# EAGLE design Cell Charger BMS rev1 (EAGLE 9.6.2)
ENGINEER: Arvind Srinivasan

## Sheet 1 of 2: Lower 9 Cell Connections
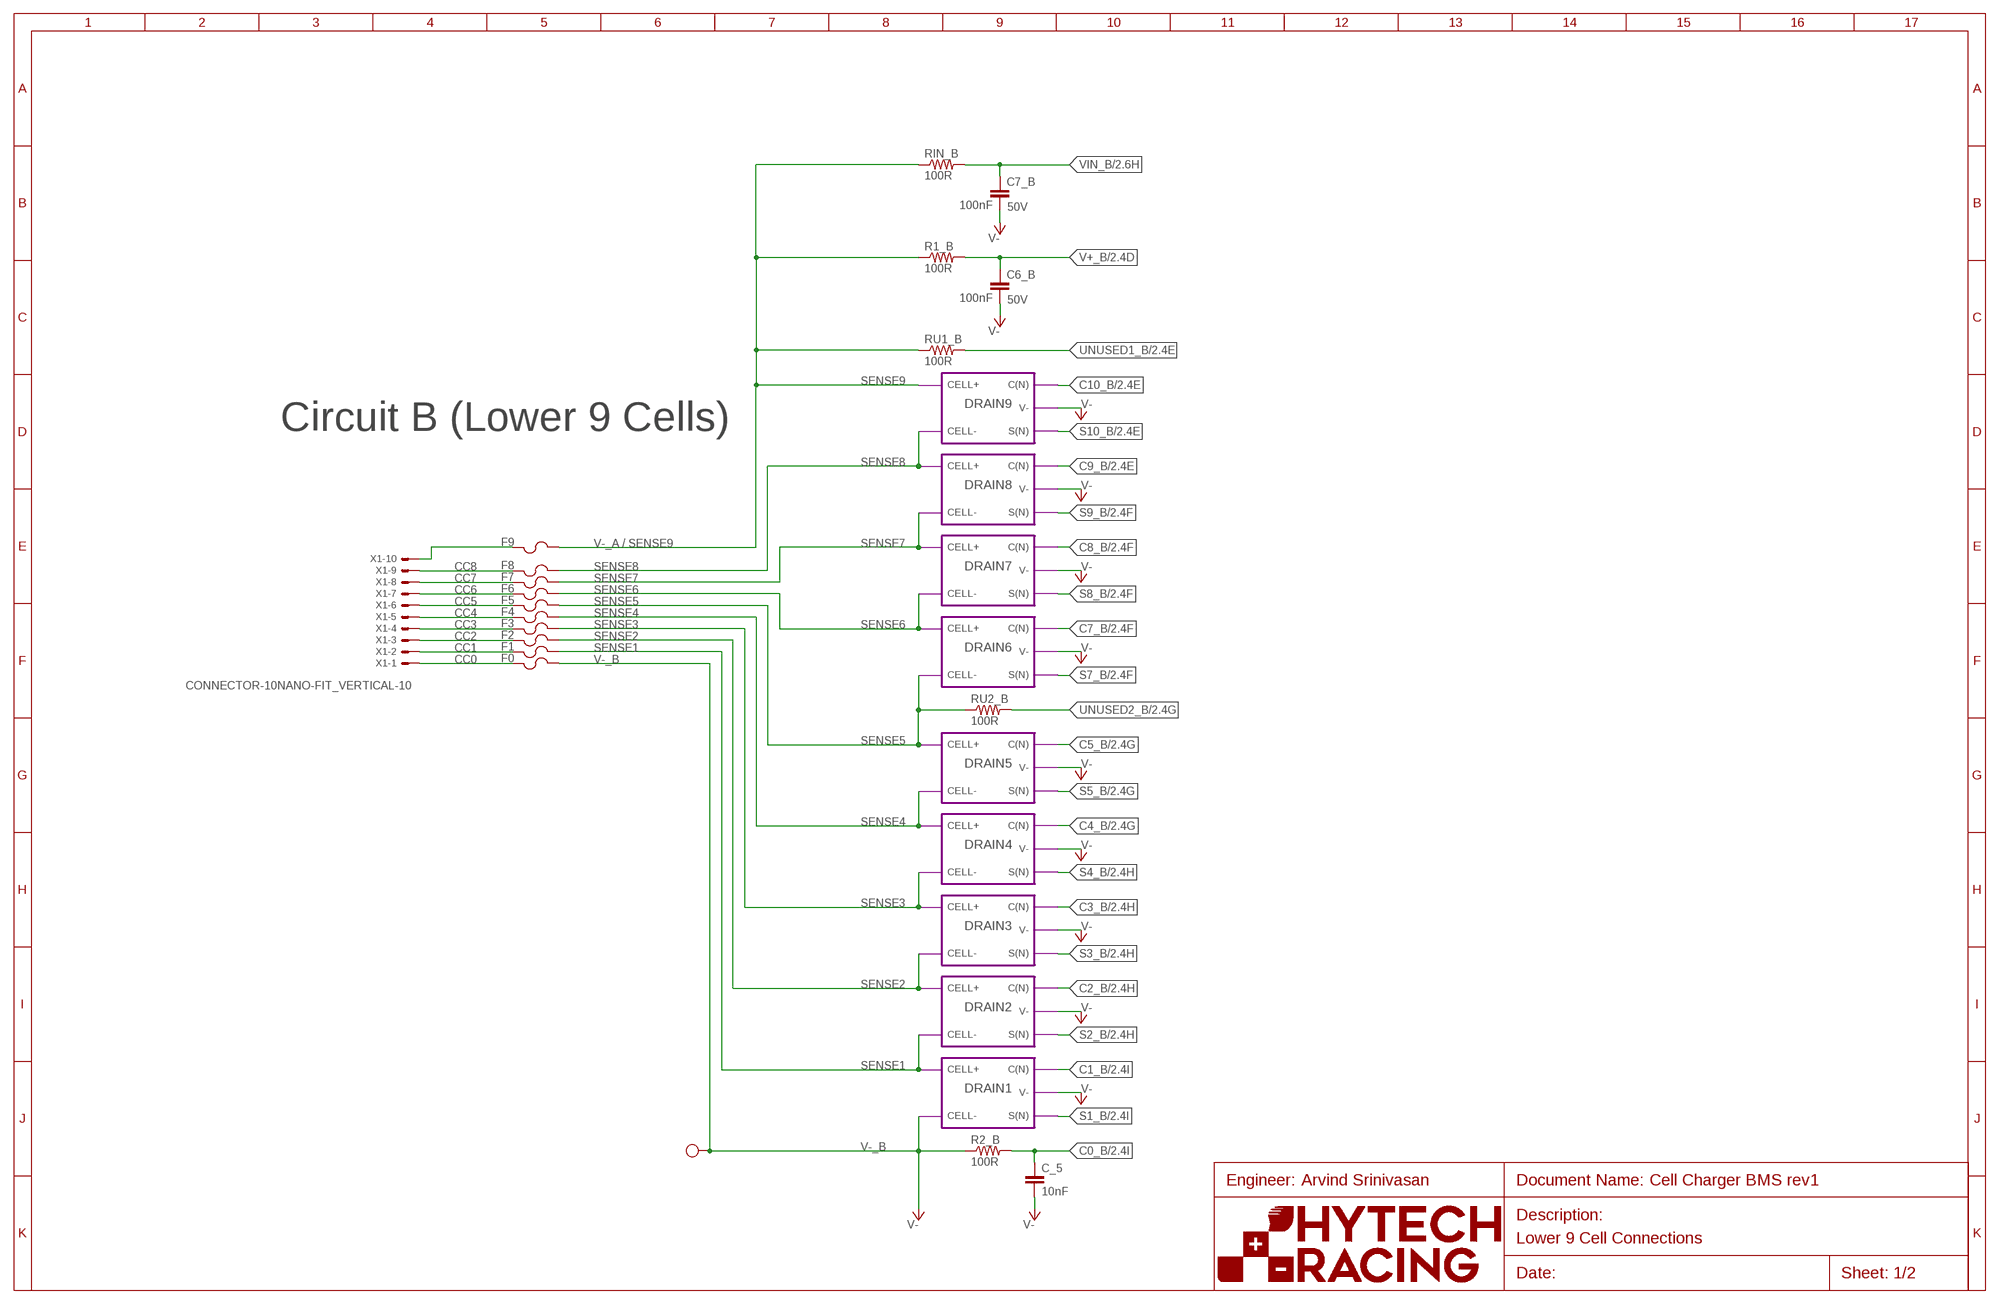
[diagram p0: schematic, sheet 1]
U$25 (FRAME_B): ENGINEER: Arvind Srinivasan; FRAME_DESCRIPTION: Lower 9 Cell Connections; ORIENTATION: LANDSCAPE; SIZE: B

### Parts
C6_B  100nF  CAP0603-CAP  [0603-CAP]
C7_B  100nF  CAP0603-CAP  [0603-CAP]
C_5  10nF  CAP0603-CAP  [0603-CAP]
F0  0001.2704.11  [5X20MM_FUSE]
F1  0001.2704.11  [5X20MM_FUSE]
F2  0001.2704.11  [5X20MM_FUSE]
F3  0001.2704.11  [5X20MM_FUSE]
F4  0001.2704.11  [5X20MM_FUSE]
F5  0001.2704.11  [5X20MM_FUSE]
F6  0001.2704.11  [5X20MM_FUSE]
F7  0001.2704.11  [5X20MM_FUSE]
F8  0001.2704.11  [5X20MM_FUSE]
F9  0001.2704.11  [5X20MM_FUSE]
R1_B  100R  RESISTOR0603-RES  [0603-RES]
R2_B  100R  RESISTOR0603-RES  [0603-RES]
RIN_B  100R  RESISTOR0603-RES  [0603-RES]
RU1_B  100R  RESISTOR0603-RES  [0603-RES]
RU2_B  100R  RESISTOR0603-RES  [0603-RES]
U$6  TEST_POINT  [TEST_POINT]
X1  CONNECTOR-10NANO-FIT_VERTICAL-10  [1053101210]

### Module instances
DRAIN1 = CELL_VOLTAGE_FILTER+DRAIN
DRAIN2 = CELL_VOLTAGE_FILTER+DRAIN
DRAIN3 = CELL_VOLTAGE_FILTER+DRAIN
DRAIN4 = CELL_VOLTAGE_FILTER+DRAIN
DRAIN5 = CELL_VOLTAGE_FILTER+DRAIN
DRAIN6 = CELL_VOLTAGE_FILTER+DRAIN
DRAIN7 = CELL_VOLTAGE_FILTER+DRAIN
DRAIN8 = CELL_VOLTAGE_FILTER+DRAIN
DRAIN9 = CELL_VOLTAGE_FILTER+DRAIN

### Nets
C0_B: C_5.1 R2_B.2 ; also sheet 2
C1_B: port DRAIN1.C(N) ; also sheet 2
C2_B: port DRAIN2.C(N) ; also sheet 2
C3_B: port DRAIN3.C(N) ; also sheet 2
C4_B: port DRAIN4.C(N) ; also sheet 2
C5_B: port DRAIN5.C(N) ; also sheet 2
C7_B: port DRAIN6.C(N) ; also sheet 2
C8_B: port DRAIN7.C(N) ; also sheet 2
C9_B: port DRAIN8.C(N) ; also sheet 2
C10_B: port DRAIN9.C(N) ; also sheet 2
CC0 [unfused_hv]: F0.P$1 X1.P$1
CC1 [unfused_hv]: F1.P$1 X1.P$2
CC2 [unfused_hv]: F2.P$1 X1.P$3
CC3 [unfused_hv]: F3.P$1 X1.P$4
CC4 [unfused_hv]: F4.P$1 X1.P$5
CC5 [unfused_hv]: F5.P$1 X1.P$6
CC6 [unfused_hv]: F6.P$1 X1.P$7
CC7 [unfused_hv]: F7.P$1 X1.P$8
CC8 [unfused_hv]: F8.P$1 X1.P$9
N$3: F9.P$1 X1.P$10
S1_B: port DRAIN1.S(N) ; also sheet 2
S2_B: port DRAIN2.S(N) ; also sheet 2
S3_B: port DRAIN3.S(N) ; also sheet 2
S4_B: port DRAIN4.S(N) ; also sheet 2
S5_B: port DRAIN5.S(N) ; also sheet 2
S7_B: port DRAIN6.S(N) ; also sheet 2
S8_B: port DRAIN7.S(N) ; also sheet 2
S9_B: port DRAIN8.S(N) ; also sheet 2
S10_B: port DRAIN9.S(N) ; also sheet 2
SENSE1: F1.P$2 ; port DRAIN1.CELL+ DRAIN2.CELL-
SENSE2: F2.P$2 ; port DRAIN2.CELL+ DRAIN3.CELL-
SENSE3: F3.P$2 ; port DRAIN3.CELL+ DRAIN4.CELL-
SENSE4: F4.P$2 ; port DRAIN4.CELL+ DRAIN5.CELL-
SENSE5: F5.P$2 RU2_B.1 ; port DRAIN5.CELL+ DRAIN6.CELL-
SENSE6: F6.P$2 ; port DRAIN6.CELL+ DRAIN7.CELL-
SENSE7: F7.P$2 ; port DRAIN7.CELL+ DRAIN8.CELL-
SENSE8: F8.P$2 ; port DRAIN8.CELL+ DRAIN9.CELL-
UNUSED1_B: RU1_B.2 ; also sheet 2
UNUSED2_B: RU2_B.2 ; also sheet 2
V+_B: C6_B.1 R1_B.2 ; also sheet 2
V-_A: F9.P$2 R1_B.1 RIN_B.1 RU1_B.1 ; port DRAIN9.CELL+
V-_B: C6_B.2 C7_B.2 C_5.2 F0.P$2 R2_B.1 U$6.P$1 ; port DRAIN1.CELL- DRAIN9.V- DRAIN8.V- DRAIN7.V- DRAIN6.V- DRAIN5.V- DRAIN4.V- DRAIN3.V- DRAIN2.V- DRAIN1.V- ; supply symbol labelled V- ; also sheet 2
VIN_B: C7_B.1 RIN_B.2 ; also sheet 2

### Notes on the sheet
- SENSE9
- Circuit B (Lower 9 Cells)
- V-_A / SENSE9

## Sheet 2 of 2: Upper LTC6811 IC
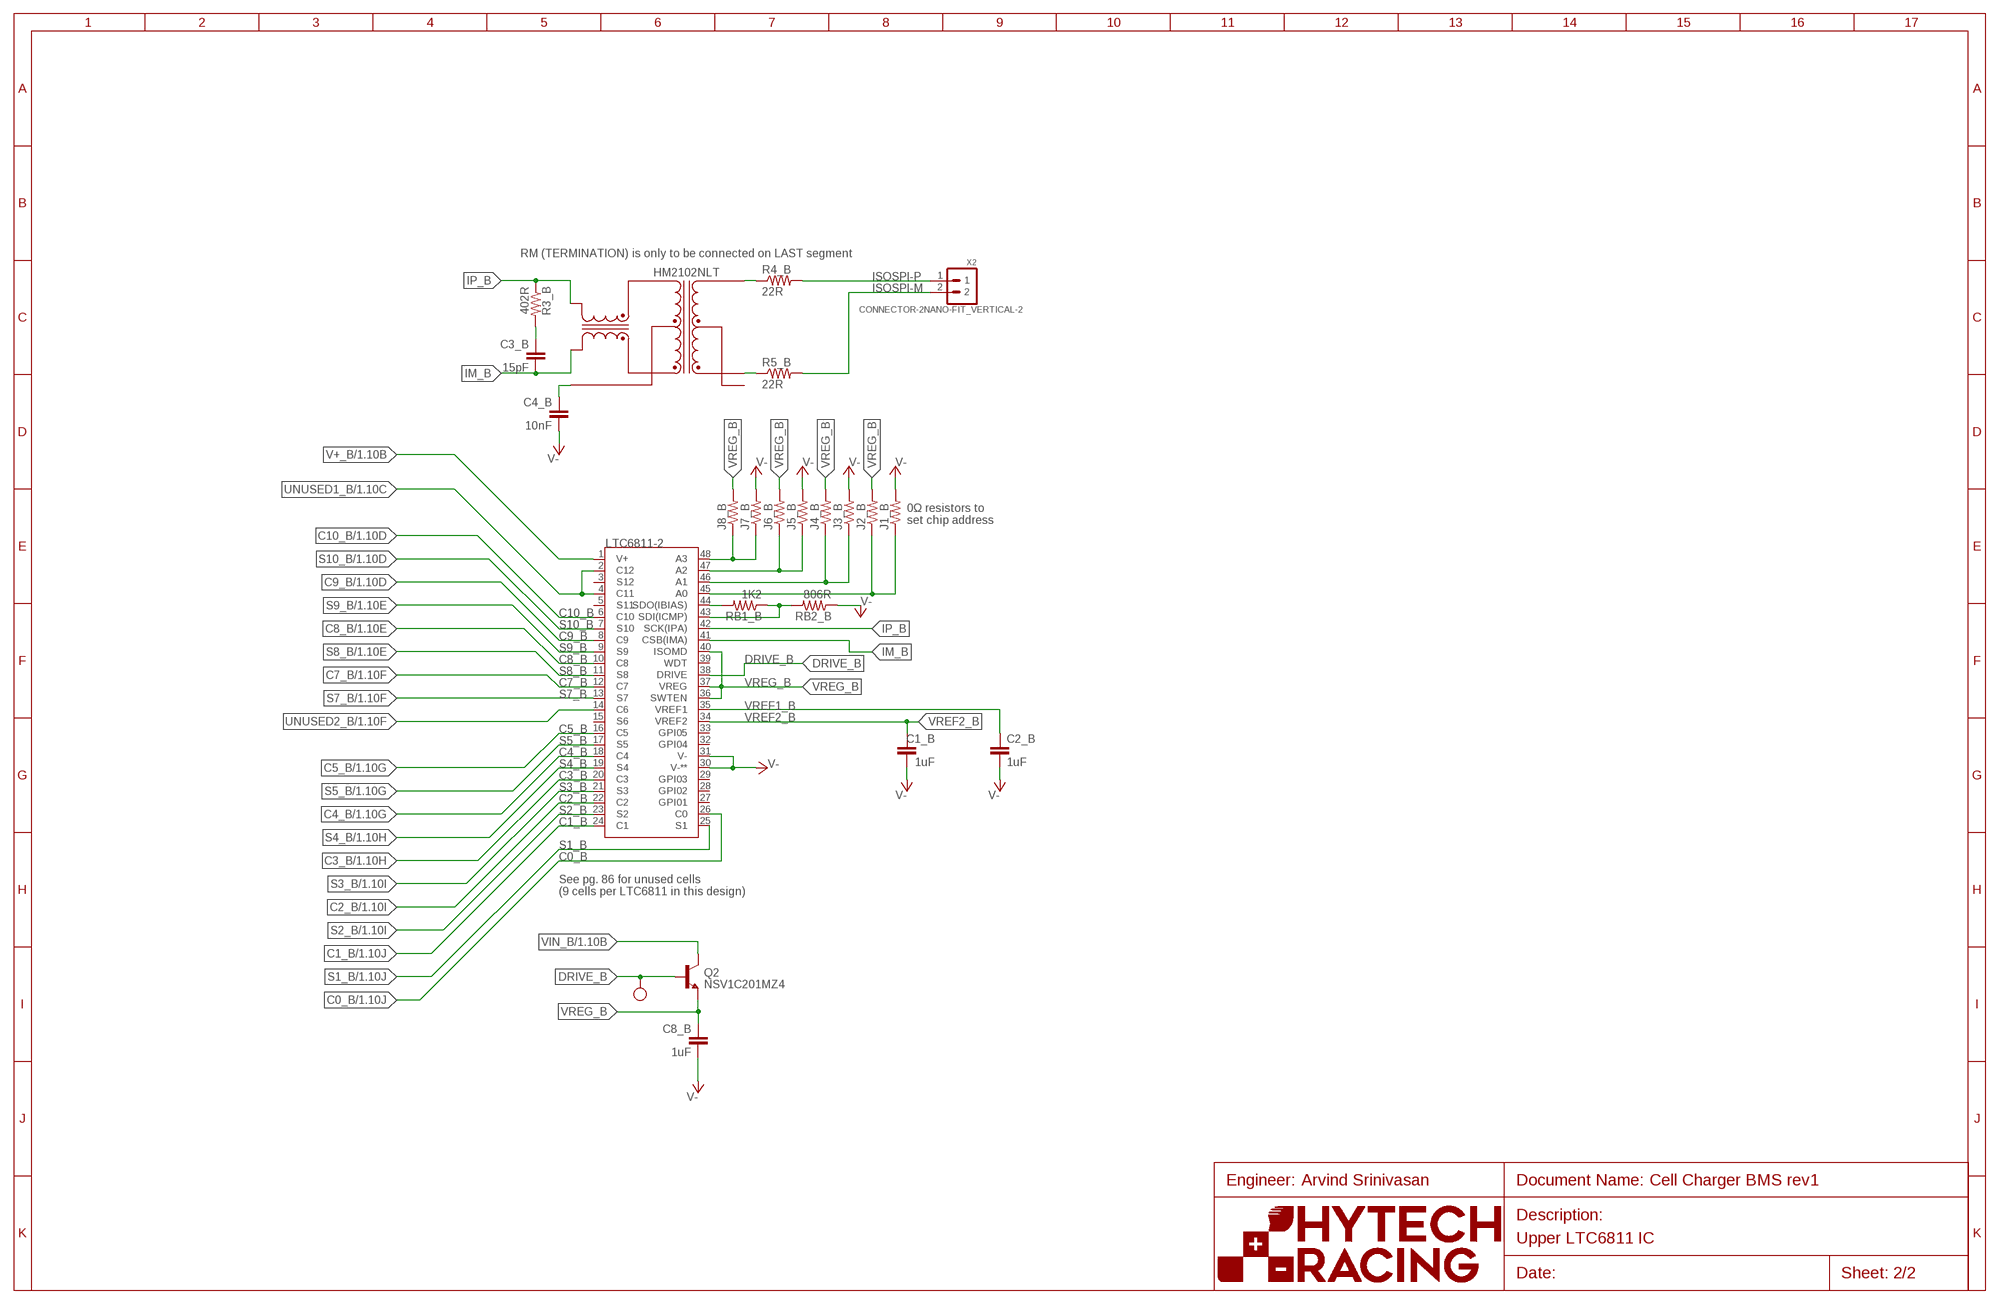
[diagram p1: schematic, sheet 2]
U$22 (FRAME_B): ENGINEER: Arvind Srinivasan; FRAME_DESCRIPTION: Upper LTC6811 IC; ORIENTATION: LANDSCAPE; SIZE: B

### Parts
C1_B  1uF  CAP0603-CAP  [0603-CAP]
C2_B  1uF  CAP0603-CAP  [0603-CAP]
C3_B  15pF  CAP0603-CAP  [0603-CAP]
C4_B  10nF  CAP0603-CAP  [0603-CAP]
C8_B  1uF  CAP0603-CAP  [0603-CAP]
J1_B  0R  RESISTOR0603-RES  [0603-RES]
J2_B  0R  RESISTOR0603-RES  [0603-RES]
J3_B  0R  RESISTOR0603-RES  [0603-RES]
J4_B  0R  RESISTOR0603-RES  [0603-RES]
J5_B  0R  RESISTOR0603-RES  [0603-RES]
J6_B  0R  RESISTOR0603-RES  [0603-RES]
J7_B  0R  RESISTOR0603-RES  [0603-RES]
J8_B  0R  RESISTOR0603-RES  [0603-RES]
Q2  NSV1C201MZ4  [SOT223]
R3_B  402R  RESISTOR0603-RES  [0603-RES]
R4_B  22R  RESISTOR0603-RES  [0603-RES]
R5_B  22R  RESISTOR0603-RES  [0603-RES]
RB1_B  1K2  RESISTOR0603-RES  [0603-RES]
RB2_B  806R  RESISTOR0603-RES  [0603-RES]
TRANSFORMER  HM2102NLT  [HM2102NLT]
U2  LTC6811-2  [LTC6811]
U$7  TEST_POINT  [TEST_POINT]
X2  CONNECTOR-2NANO-FIT_VERTICAL-2  [1053091202]

### Nets
C0_B: U2.26(C0) ; also sheet 1
C1_B: U2.24(C1) ; also sheet 1
C2_B: U2.22(C2) ; also sheet 1
C3_B: U2.20(C3) ; also sheet 1
C4_B: U2.18(C4) ; also sheet 1
C5_B: U2.16(C5) ; also sheet 1
C7_B: U2.12(C7) ; also sheet 1
C8_B: U2.10(C8) ; also sheet 1
C9_B: U2.8(C9) ; also sheet 1
C10_B: U2.6(C10) ; also sheet 1
DRIVE_B: Q2.1(BASE) U2.38(DRIVE) U$7.P$1
IM_B: C3_B.2 TRANSFORMER.P$12(TD+) U2.41(CSB(IMA))
IP_B: R3_B.1 TRANSFORMER.P$10(TD-) U2.42(SCK(IPA))
ISOSPI-M: R5_B.2 X2.2
ISOSPI-P: R4_B.2 X2.1
N$1: C4_B.1 TRANSFORMER.P$11(TCT)
N$2: RB1_B.2 U2.44(SDO(IBIAS))
N$4: RB1_B.1 RB2_B.2 U2.43(SDI(ICMP))
N$5: R4_B.1 TRANSFORMER.P$3(MX-)
N$7: R5_B.1 TRANSFORMER.P$1(MX+)
N$8: J7_B.1 J8_B.1 U2.48(A3)
N$9: J5_B.1 J6_B.1 U2.47(A2)
N$10: C3_B.1 R3_B.2
N$13: J3_B.1 J4_B.1 U2.46(A1)
N$16: J1_B.1 J2_B.1 U2.45(A0)
S1_B: U2.25(S1) ; also sheet 1
S2_B: U2.23(S2) ; also sheet 1
S3_B: U2.21(S3) ; also sheet 1
S4_B: U2.19(S4) ; also sheet 1
S5_B: U2.17(S5) ; also sheet 1
S7_B: U2.13(S7) ; also sheet 1
S8_B: U2.11(S8) ; also sheet 1
S9_B: U2.9(S9) ; also sheet 1
S10_B: U2.7(S10) ; also sheet 1
UNUSED1_B: U2.2(C12) U2.4(C11) ; also sheet 1
UNUSED2_B: U2.14(C6) ; also sheet 1
V+_B: U2.1(V+) ; also sheet 1
V-_B: C1_B.2 C2_B.2 C4_B.2 C8_B.2 J1_B.2 J3_B.2 J5_B.2 J7_B.2 RB2_B.1 U2.30(V-**) U2.31(V-) ; supply symbol labelled V- ; also sheet 1
VIN_B: Q2.2(COLLECTOR) Q2.4(COLLECTOR) ; also sheet 1
VREF1_B: C2_B.1 U2.35(VREF1)
VREF2_B: C1_B.1 U2.34(VREF2)
VREG_B: C8_B.1 J2_B.2 J4_B.2 J6_B.2 J8_B.2 Q2.3(EMITTER) U2.36(SWTEN) U2.37(VREG) U2.40(ISOMD)
Unconnected: TRANSFORMER.P$2(MCT) TRANSFORMER.P$4(MX+) TRANSFORMER.P$5(MCT) TRANSFORMER.P$6(MX-) TRANSFORMER.P$7(TD-) TRANSFORMER.P$8(TCT) TRANSFORMER.P$9(TD+) U2.3(S12) U2.5(S11) U2.15(S6) U2.27(GPI01) U2.28(GPI02) U2.29(GPI03) U2.32(GPI04) U2.33(GPI05) U2.39(WDT)

### Notes on the sheet
- RM (TERMINATION) is only to be connected on LAST segment
- 0Ω resistors to
  set chip address
- LTC6811-2
- See pg. 86 for unused cells
  (9 cells per LTC6811 in this design)

## Library data of the parts
C1_B C2_B C3_B C4_B C8_B C_5 = HyTechDevices:CAP: Capacitor Standard 0603 ceramic capacitor, and 0.1" leaded capacitor.; TOLERANCE: 5%; VOLTAGE: 10V
C6_B C7_B = HyTechDevices:CAP: Capacitor Standard 0603 ceramic capacitor, and 0.1" leaded capacitor.; TOLERANCE: 5%; VOLTAGE: 50V
F0 F1-F9 = HyTechDevices:0001.2704.11: Schurter Surface Mount Ceramic Fuse Current Rating: 1A Voltage Rating AC: 250 VAC Voltage Rating DC: 300 VDC Dimensions: 5 mm x 20 mm Datasheet <http://www.mouser.com/ds/2/358/typ_SMD-SPT-46594.pdf>; RATING: 1A
J1_B J2_B J3_B J4_B J5_B J6_B J7_B J8_B R1_B R2_B R3_B R4_B R5_B RB1_B RB2_B RIN_B RU1_B RU2_B = HyTechDevices:RESISTOR: Resistor Basic schematic elements and footprints for 0603, 1206, and PTH resistors.; TOLERANCE: 1%
Q2 = HyTechDevices:NSV1C201MZ4: NPN Transistor Datasheet <http://www.onsemi.com/pub/Collateral/NSS1C201MZ4-D.PDF> MAX current: 2.0A MAX voltage: 100V
TRANSFORMER = HyTechDevices:HM2102NLT: 2 Channel SMT Transformer Turns ratio: 1CT: 1CT Isolation Voltage: 4300 VDC Inductance: 150 uH Leakage Inductance: 0.50 uH max DataSheet <https://www.mouser.com/datasheet/2/336/HM2102NL-1218600.pdf>
U2 = HyTechDevices:LTC6811-2: Linear Technology Multicell Battery Stack Monitor Variant 2: Addressable/Multi-Drop Configuration Datasheet <http://cds.linear.com/docs/en/datasheet/680412fc.pdf>
U$6 U$7 = HyTechDevices:TEST_POINT: Keystone Electronics Test Point 5005
X1 = HyTechDevices:CONNECTOR-10: Mini-Fit Junior connector 10 pole Source: http://www.molex.com
X2 = HyTechDevices:CONNECTOR-2: Mini-Fit Junior connector 2 pole Source: http://www.molex.com

## Module CELL_VOLTAGE_FILTER+DRAIN
Ports: CELL+(in) CELL-(pas) S(N)(in) C(N)(out) V-(pwr)
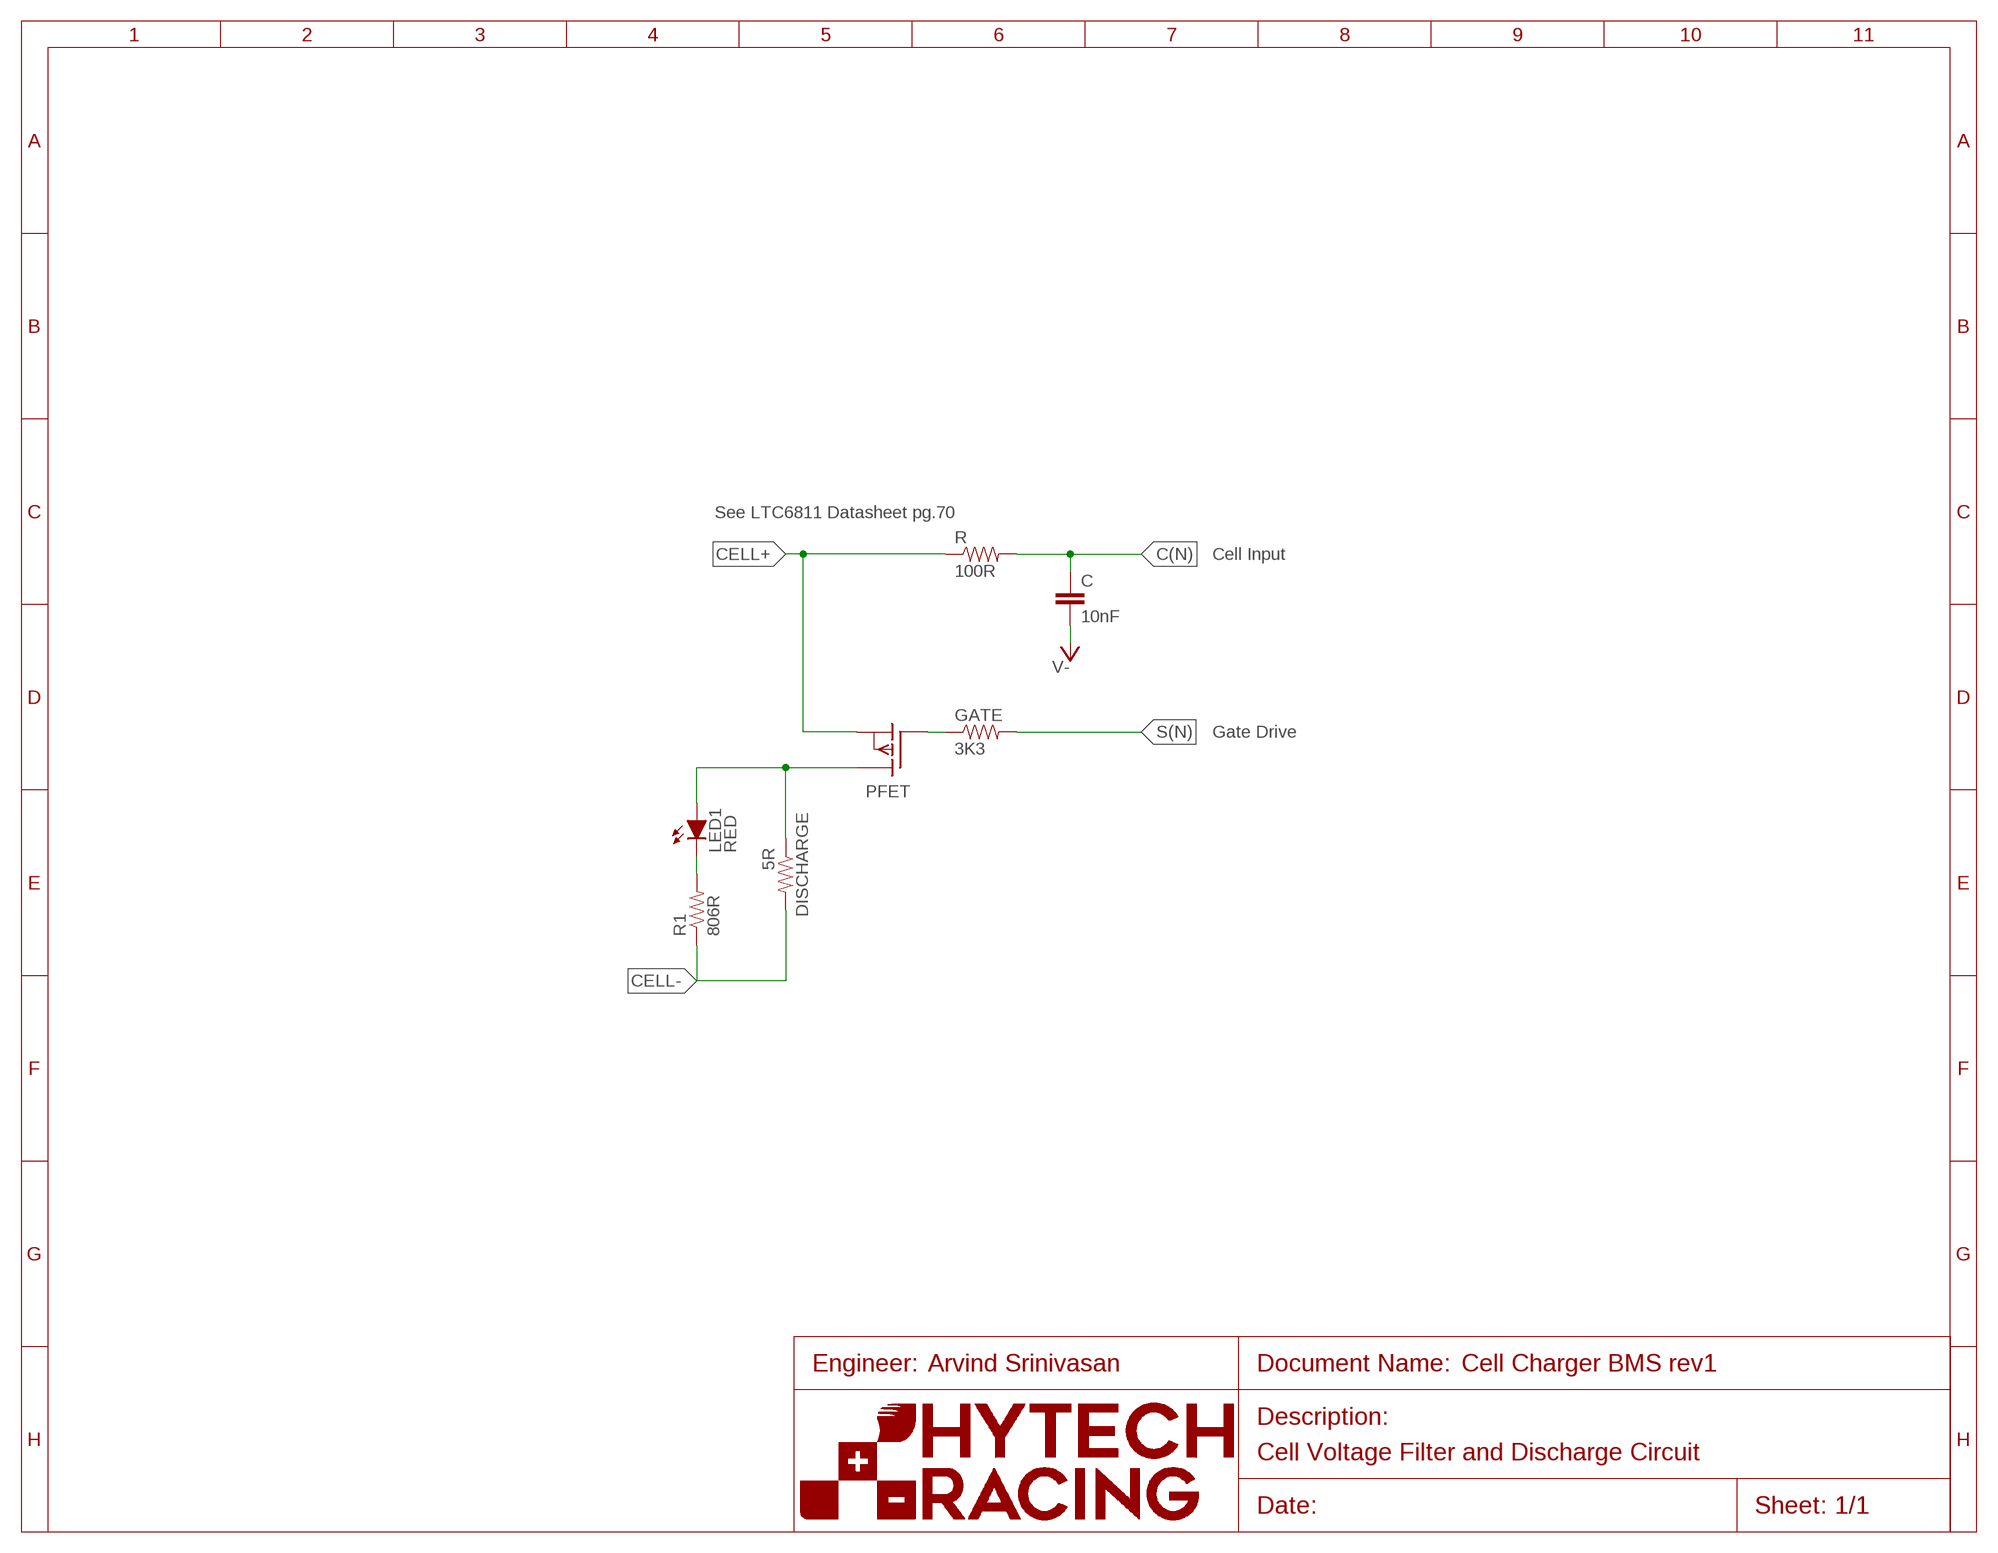
[diagram p2: schematic, module CELL_VOLTAGE_FILTER+DRAIN, sheet 1]
U$1 (FRAME_A): FRAME_DESCRIPTION: Default; ORIENTATION: LANDSCAPE; SIZE: A

### Parts
C  10nF  CAP0603-CAP  [0603-CAP]
DISCHARGE  5R  RESISTORPWR163  [PWR163]
GATE  3K3  RESISTOR0603-RES  [0603-RES]
LED1  RED  LED-0603  [LED-603]
PFET  P-CHANNEL_MOSFET_DMP3099L-7  [SOT23]
R  100R  RESISTOR0603-RES  [0603-RES]
R1  806R  RESISTOR0603-RES  [0603-RES]

### Nets
C(N): C.1 R.2
CELL+: PFET.2(S) R.1
CELL-: DISCHARGE.2 R1.1
GATE: GATE.1 PFET.1(G)
N$1: DISCHARGE.1 LED1.A PFET.3(D)
N$2: LED1.C R1.2
S(N): GATE.2
V-: C.2

### Notes on the sheet
- See LTC6811 Datasheet pg.70
- Cell Input
- Gate Drive
- Arvind Srinivasan
- Cell Voltage Filter and Discharge Circuit

### Library data of the parts
C = HyTechDevices:CAP: Capacitor Standard 0603 ceramic capacitor, and 0.1" leaded capacitor.; TOLERANCE: 5%; VOLTAGE: 10V
DISCHARGE = HyTechDevices:RESISTOR: Resistor Basic schematic elements and footprints for 0603, 1206, and PTH resistors.; TOLERANCE: 5%
GATE R R1 = HyTechDevices:RESISTOR: Resistor Basic schematic elements and footprints for 0603, 1206, and PTH resistors.; TOLERANCE: 1%
LED1 = HyTechDevices:LED: Light Emitting Diode (LED) Source: Dangerous Prototypes Eagle Library <https://github.com/DangerousPrototypes/Eagle_Part_Library>; DKPN: 350-2038-1-ND
PFET = HyTechDevices:P-CHANNEL_MOSFET_DMP3099L-7: Diodes Incorporated P-Channel Enhancement Mode MOSFET Datasheet <http://www.mouser.com/ds/2/115/DMP3099L-266220.pdf>

## Module CELL_THERM_FILTER
Ports: VREF(pwr) GPIO(out) THERM(in) V-(pwr)
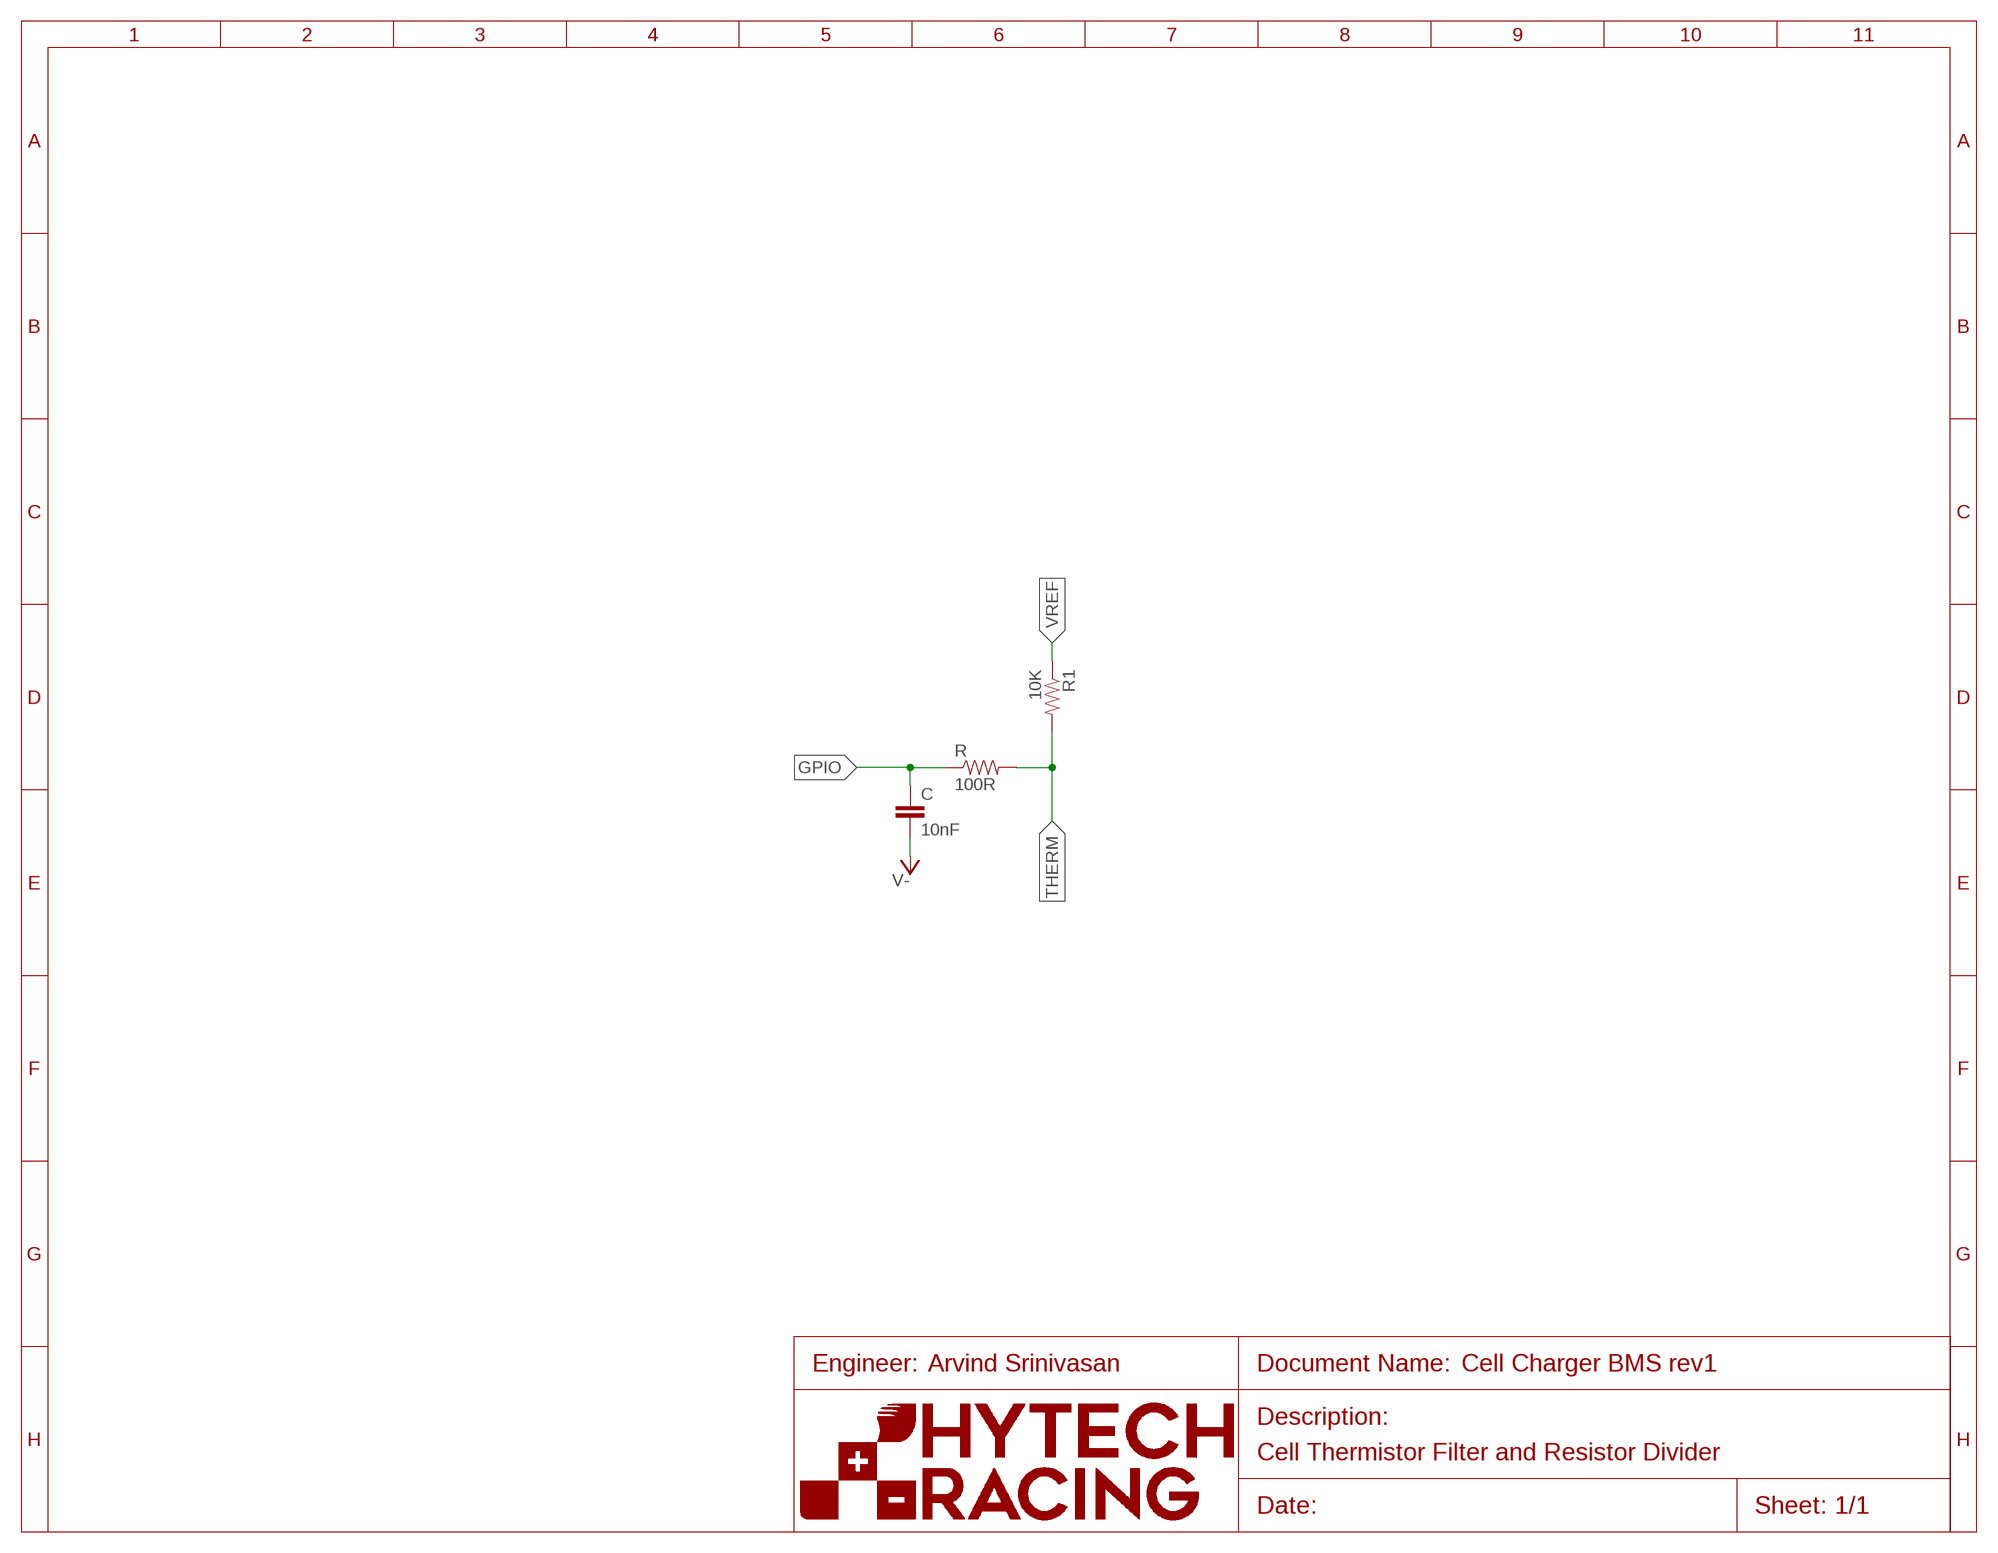
[diagram p3: schematic, module CELL_THERM_FILTER, sheet 1]
U$1 (FRAME_A): FRAME_DESCRIPTION: Default; ORIENTATION: LANDSCAPE; SIZE: A

### Parts
C  10nF  CAP0603-CAP  [0603-CAP]
R  100R  RESISTOR0603-RES  [0603-RES]
R1  10K  RESISTOR0603-RES  [0603-RES]

### Nets
GPIO: C.1 R.1
THERM: R1.2 R.2
V-: C.2
VREF: R1.1

### Notes on the sheet
- Arvind Srinivasan
- Cell Thermistor Filter and Resistor Divider

### Library data of the parts
C = HyTechDevices:CAP: Capacitor Standard 0603 ceramic capacitor, and 0.1" leaded capacitor.; TOLERANCE: 5%; VOLTAGE: 10V
R R1 = HyTechDevices:RESISTOR: Resistor Basic schematic elements and footprints for 0603, 1206, and PTH resistors.; TOLERANCE: 1%

## Net classes
1 unfused_hv: clearance 0.025 mm to class 0, clearance 3.2 mm

## Board
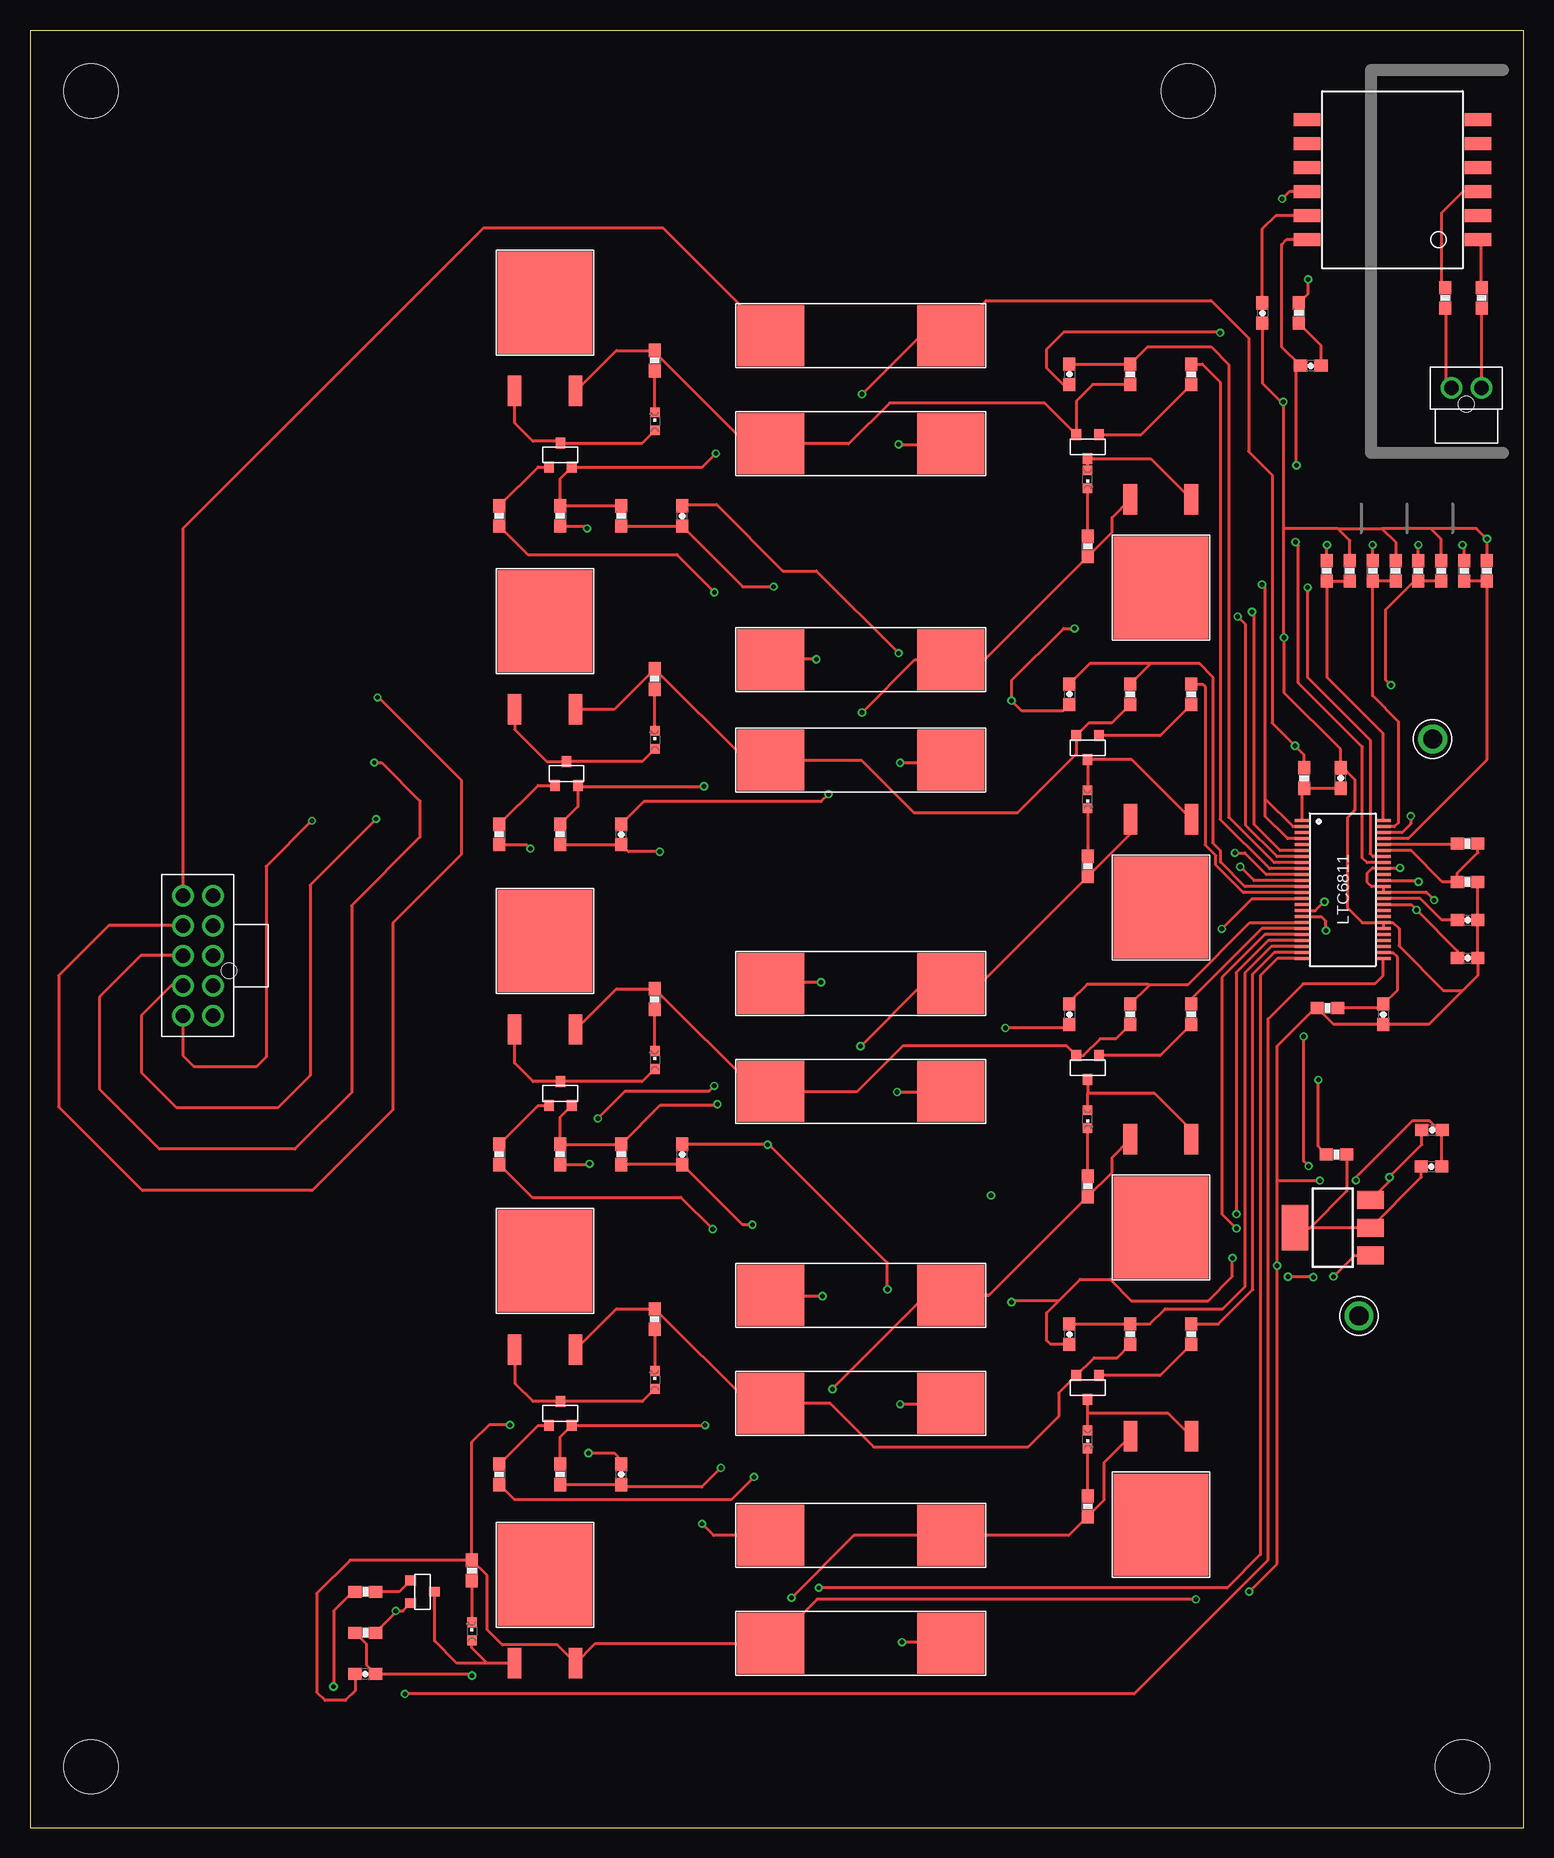
[diagram p4: board, top side]
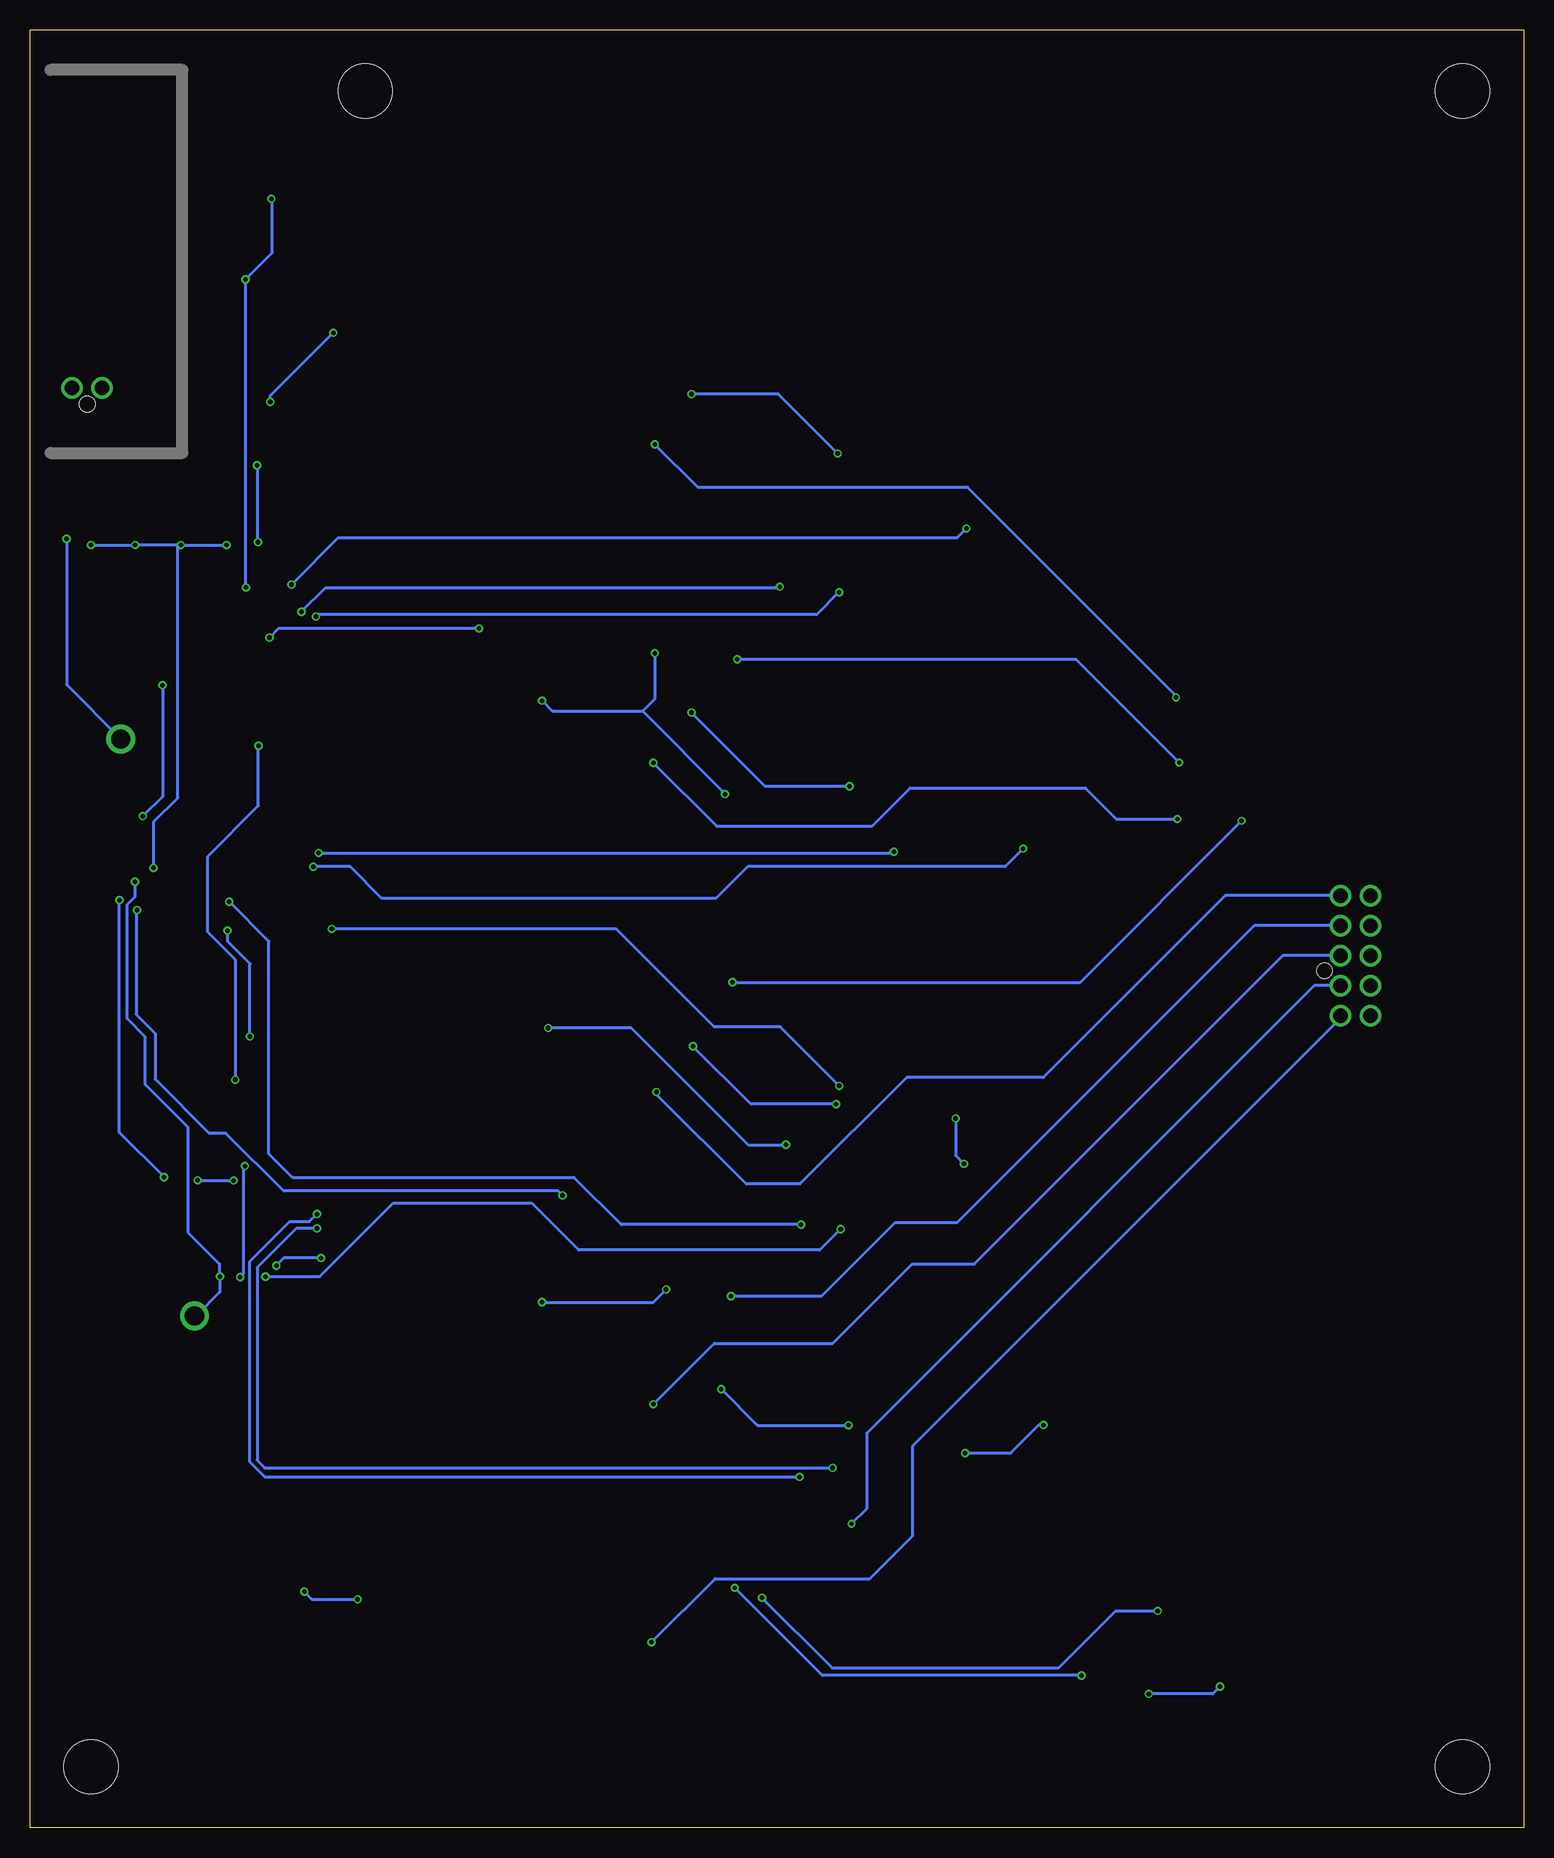
[diagram p5: board, bottom side, seen from below]

Size 124.46 x 149.86 mm. Coordinates in mm from the lower left corner, seen from the top.
Outline: 0,149.86 124.46,149.86 124.46,0 0,0 0,149.86
Copper layers (1*16): Top 0.035mm / dielectric 1.53mm / Bottom 0.035mm
Design rules "JLCPCB (2 Layer)": minimum track width 5mil, minimum drill 0.3mm, track to track 5mil, track to pad 5mil, pad to pad 5mil, via to via 20mil, smd to smd 5mil, copper to edge 0.2mm, drill to drill 21mil, minimum pad ring 6mil, minimum via ring 6mil, stop-mask expansion 6mil, vias tented up to drill 30mil, thermal gap 10mil

### Footprints (pad centres in the part's own frame; a part is rotated, then mirrored left to right if it is on the bottom)
0603-CAP = smd 1.1 x 1: 1 -0.85,0; 2 0.85,0
PWR163 = smd 1.143 x 2.54: 1 -2.54,-7.366; 2 2.54,-7.366 | smd 7.874 x 8.509: PAD 0,0
0603-RES = smd 1.1 x 1: 1 -0.85,0; 2 0.85,0
LED-603 = smd 0.8 x 0.8: A 0,-0.75; C 0,0.75
SOT23 = smd 0.8 x 0.9: 1 -0.95,-1; 2 0.95,-1; 3 0,1
5X20MM_FUSE = smd 5.588 x 5.08: P$1 -7.493,0; P$2 7.493,0
SOT223 = smd 1.5 x 2.235: 1 -2.3,-3.15; 2 0,-3.15; 3 2.3,-3.15 | smd 3.8 x 2.2: 4 0,3.15
HM2102NLT = smd 1.067 x 2.184: P$1 0,0; P$2 2,0; P$3 4,0; P$4 6,0; P$5 8,0; P$6 10,0; P$7 10,14.25; P$8 8,14.25; P$9 6,14.25; P$10 4,14.25; P$11 2,14.25; P$12 0,14.25
LTC6811 = smd 0.25 x 1.25: 1 -5.75,-3.37; 2 -5.25,-3.37; 3 -4.75,-3.37; 4 -4.25,-3.37; 5 -3.75,-3.37; 6 -3.25,-3.37; 7 -2.75,-3.37; 8 -2.25,-3.37; 9 -1.75,-3.37; 10 -1.25,-3.37; 11 -0.75,-3.37; 12 -0.25,-3.37; 13 0.25,-3.37; 14 0.75,-3.37; 15 1.25,-3.37; 16 1.75,-3.37; 17 2.25,-3.37; 18 2.75,-3.37; 19 3.25,-3.37; 20 3.75,-3.37; 21 4.25,-3.37; 22 4.75,-3.37; 23 5.25,-3.37; 24 5.75,-3.37; 25 5.75,3.38; 26 5.25,3.38; 27 4.75,3.38; 28 4.25,3.38; 29 3.75,3.38; 30 3.25,3.38; 31 2.75,3.38; 32 2.25,3.38; 33 1.75,3.38; 34 1.25,3.38; 35 0.75,3.38; 36 0.25,3.38; 37 -0.25,3.38; 38 -0.75,3.38; 39 -1.25,3.38; 40 -1.75,3.38; 41 -2.25,3.38; 42 -2.75,3.38; 43 -3.25,3.38; 44 -3.75,3.38; 45 -4.25,3.38; 46 -4.75,3.38; 47 -5.25,3.38; 48 -5.75,3.38
TEST_POINT = drill 1.6: P$1 0,0
M4_MOUNTING = hole 4.5: 0,0
1053101210 = drill 1.2: P$1 -5,0; P$2 -2.5,0; P$3 0,0; P$4 2.5,0; P$5 5,0; P$6 -5,2.5; P$7 -2.5,2.5; P$8 0,2.5; P$9 2.5,2.5; P$10 5,2.5 | hole 1.3: -1.27,-1.34
1053091202 = drill 1.2: 1 -1.25,0; 2 1.25,0 | hole 1.3: 0,-1.34

### Placement (x,y rotation side)
C1_B  119.8,72.5 0 top
C2_B  119.8,75.68 0 top
C3_B  106.73,121.86 180 top
C4_B  102.7,126.27 270 top
C6_B  109.22,87.5 90 top
C7_B  116.79,55.12 0 top
C8_B  116.84,58.17 0 top
C_5  112.78,67.82 270 top
DRAIN1:C  10nF  [0603-CAP]  27.94,12.83 180 top
DRAIN1:DISCHARGE  5R  [PWR163]  42.93,21.08 0 top
DRAIN1:GATE  3K3  [0603-RES]  27.94,19.68 180 top
DRAIN1:LED1  RED  [LED-603]  36.83,16.38 0 top
DRAIN1:PFET  P-CHANNEL_MOSFET_DMP3099L-7  [SOT23]  32.72,19.68 270 top
DRAIN1:R  100R  [0603-RES]  27.94,16.26 180 top
DRAIN1:R1  806R  [0603-RES]  36.83,21.46 270 top
DRAIN2:C  10nF  [0603-CAP]  86.61,41.15 270 top
DRAIN2:DISCHARGE  5R  [PWR163]  94.24,25.27 180 top
DRAIN2:GATE  3K3  [0603-RES]  96.77,41.15 90 top
DRAIN2:LED1  RED  [LED-603]  88.14,32.38 180 top
DRAIN2:PFET  P-CHANNEL_MOSFET_DMP3099L-7  [SOT23]  88.14,36.7 180 top
DRAIN2:R  100R  [0603-RES]  91.69,41.15 90 top
DRAIN2:R1  806R  [0603-RES]  88.14,26.8 90 top
DRAIN3:C  10nF  [0603-CAP]  49.28,29.46 90 top
DRAIN3:DISCHARGE  5R  [PWR163]  42.93,47.24 0 top
DRAIN3:GATE  3K3  [0603-RES]  39.12,29.46 270 top
DRAIN3:LED1  RED  [LED-603]  52.07,37.34 0 top
DRAIN3:PFET  P-CHANNEL_MOSFET_DMP3099L-7  [SOT23]  44.2,34.54 0 top
DRAIN3:R  100R  [0603-RES]  44.2,29.46 270 top
DRAIN3:R1  806R  [0603-RES]  52.07,42.42 270 top
DRAIN4:C  10nF  [0603-CAP]  86.61,67.82 270 top
DRAIN4:DISCHARGE  5R  [PWR163]  94.23,50.04 180 top
DRAIN4:GATE  3K3  [0603-RES]  96.77,67.82 90 top
DRAIN4:LED1  RED  [LED-603]  88.14,59.05 180 top
DRAIN4:PFET  P-CHANNEL_MOSFET_DMP3099L-7  [SOT23]  88.14,63.37 180 top
DRAIN4:R  100R  [0603-RES]  91.69,67.82 90 top
DRAIN4:R1  806R  [0603-RES]  88.14,53.47 90 top
DRAIN5:C  10nF  [0603-CAP]  54.36,56.13 90 top
DRAIN5:DISCHARGE  5R  [PWR163]  42.93,73.91 0 top
DRAIN5:GATE  3K3  [0603-RES]  39.12,56.13 270 top
DRAIN5:LED1  RED  [LED-603]  52.07,64.01 0 top
DRAIN5:PFET  P-CHANNEL_MOSFET_DMP3099L-7  [SOT23]  44.2,61.21 0 top
DRAIN5:R  100R  [0603-RES]  49.28,56.13 270 top
DRAIN5:R1  806R  [0603-RES]  52.07,69.09 270 top
DRAIN6:C  10nF  [0603-CAP]  86.61,94.49 270 top
DRAIN6:DISCHARGE  5R  [PWR163]  94.24,76.71 180 top
DRAIN6:GATE  3K3  [0603-RES]  96.77,94.49 90 top
DRAIN6:LED1  RED  [LED-603]  88.14,85.72 180 top
DRAIN6:PFET  P-CHANNEL_MOSFET_DMP3099L-7  [SOT23]  88.14,90.04 180 top
DRAIN6:R  100R  [0603-RES]  91.69,94.49 90 top
DRAIN6:R1  806R  [0603-RES]  88.14,80.14 90 top
DRAIN7:C  10nF  [0603-CAP]  49.28,82.8 90 top
DRAIN7:DISCHARGE  5R  [PWR163]  42.93,100.58 0 top
DRAIN7:GATE  3K3  [0603-RES]  39.12,82.8 270 top
DRAIN7:LED1  RED  [LED-603]  52.07,90.68 0 top
DRAIN7:PFET  P-CHANNEL_MOSFET_DMP3099L-7  [SOT23]  44.7,87.88 0 top
DRAIN7:R  100R  [0603-RES]  44.2,82.8 270 top
DRAIN7:R1  806R  [0603-RES]  52.07,95.76 270 top
DRAIN8:C  10nF  [0603-CAP]  86.61,121.16 270 top
DRAIN8:DISCHARGE  5R  [PWR163]  94.23,103.38 180 top
DRAIN8:GATE  3K3  [0603-RES]  96.77,121.16 90 top
DRAIN8:LED1  RED  [LED-603]  88.14,112.39 180 top
DRAIN8:PFET  P-CHANNEL_MOSFET_DMP3099L-7  [SOT23]  88.14,115.13 180 top
DRAIN8:R  100R  [0603-RES]  91.69,121.16 90 top
DRAIN8:R1  806R  [0603-RES]  88.14,106.81 90 top
DRAIN9:C  10nF  [0603-CAP]  54.36,109.35 90 top
DRAIN9:DISCHARGE  5R  [PWR163]  42.93,127.13 0 top
DRAIN9:GATE  3K3  [0603-RES]  39.12,109.35 270 top
DRAIN9:LED1  RED  [LED-603]  52.07,117.22 0 top
DRAIN9:PFET  P-CHANNEL_MOSFET_DMP3099L-7  [SOT23]  44.2,114.43 0 top
DRAIN9:R  100R  [0603-RES]  49.28,109.35 270 top
DRAIN9:R1  806R  [0603-RES]  52.07,122.3 270 top
F0  69.24,15.37 180 top
F1  69.24,24.37 0 top
F2  69.24,35.37 180 top
F3  69.24,44.37 0 top
F4  69.24,61.37 180 top
F5  69.24,70.37 0 top
F6  69.24,89 180 top
F7  69.24,97.37 0 top
F8  69.24,115.37 180 top
F9  69.24,124.37 0 top
J1_B  121.41,104.78 90 top
J2_B  119.51,104.78 90 top
J3_B  117.6,104.78 90 top
J4_B  115.7,104.78 90 top
J5_B  113.79,104.78 90 top
J6_B  111.89,104.78 90 top
J7_B  109.98,104.78 90 top
J8_B  108.08,104.78 90 top
Q2  108.56,50.02 90 top
R1_B  106.17,87.5 270 top
R2_B  108.12,68.33 0 top
R3_B  105.75,126.27 270 top
R4_B  117.94,127.53 270 top
R5_B  120.99,127.53 270 top
RB1_B  119.8,82.03 180 top
RB2_B  119.8,78.85 180 top
RIN_B  108.88,56.13 0 top
RU1_B  44.2,109.35 270 top
RU2_B  44.2,56.13 270 top
TRANSFORMER  120.68,132.37 90 top
U2  109.39,78.21 270 top
U$6  116.89,90.76 90 top
U$7  110.74,42.67 0 top
U$13  [M4_MOUNTING]  5.08,5.08 0 top
U$14  [M4_MOUNTING]  119.38,5.08 0 top
U$16  [M4_MOUNTING]  96.52,144.78 0 top
U$27  [M4_MOUNTING]  5.08,144.78 0 top
X1  15.24,72.71 90 top
X2  119.7,120.02 0 top

### Tracks (layer width: path | path; a pad name or v marks a point on that pad's centre or on a via)
C0_B
  Top 0.254: U2.26 113.58,72.95 113.96,72.57 113.96,69.85 C_5.1 112.43,68.33 R2_B.2
C1_B  (via drill 0.35, 0.38)
  Top 0.254: U2.24 103.93,72.45 102.53,71.06 102.53,22.78 99.75,20 v65.72,20 | v36.83,12.7 36.7,12.83 DRAIN1:C.1 28.02,13.59 28.02,15.32 DRAIN1:R.2
  Bottom 0.254: v36.83,12.7 58.42,12.7 v65.72,20
C2_B
  Top 0.254: U2.22 103.42,73.45 101.26,71.3 101.26,45.13 99.39,43.26 94.59,43.26 93.33,42 DRAIN2:R.2 DRAIN2:C.1
C3_B  (via drill 0.38)
  Top 0.254: U2.20 102.91,74.45 99.32,70.86 99.32,51.19 v100.54,49.97 | DRAIN3:R.2 DRAIN3:C.1 49.47,28.42 55.98,28.42 v57.57,30.01
  Bottom 0.254: v57.57,30.01 104.9,30.01 105.54,30.64 105.54,46.7 102.27,49.97 v100.54,49.97
C4_B
  Top 0.254: DRAIN4:R.2 93.26,70.23 93.17,70.31 | DRAIN4:C.1 86.61,68.83 88.09,70.31 93.17,70.31 | 93.17,70.31 96.52,70.31 101.66,75.45 U2.18
C5_B  (via drill 0.38)
  Top 0.254: U2.16 107.12,76.45 v107.87,77.2 | v60.2,50.28 59.36,50.28 DRAIN5:C.1 DRAIN5:R.2
  Bottom 0.254: v60.2,50.28 75.2,50.28 79.13,54.22 102.6,54.22 104.56,56.18 104.56,73.9 v107.87,77.2
C7_B
  Top 0.254: 93.38,97.03 97.46,97.03 98.55,95.94 98.55,82.1 99.22,81.44 99.22,80.49 101.25,78.45 U2.12 | 93.38,97.03 88.3,97.03 DRAIN6:C.1 | DRAIN6:R.2 93.38,97.03
C8_B  (via drill 0.38)
  Top 0.254: U2.10 103.04,79.45 101.23,81.26 v100.41,81.26 | v52.48,81.37 49.86,81.37 DRAIN7:C.1 DRAIN7:R.2
  Bottom 0.254: v52.48,81.37 52.58,81.26 v100.41,81.26
C9_B
  Top 0.254: DRAIN8:C.1 DRAIN8:R.2 93.13,123.44 98.42,123.44 99.89,121.98 99.89,84.25 103.67,80.45 U2.8
C10_B  (via drill 0.38)
  Top 0.254: DRAIN9:R.2 DRAIN9:C.1 59.39,103.46 v61.98,103.46 | U2.6 104.18,81.45 101.98,83.66 101.98,101.22 v101.84,101.37
  Bottom 0.254: v61.98,103.46 62.08,103.35 99.85,103.35 v101.84,101.37
CC0  (via drill 0.38)
  Top 0.254: F0.P$1 76.63,15.47 v72.67,15.47
  Bottom 0.254: v72.67,15.47 67.37,20.77 54.48,20.77 50.9,24.35 50.9,31.85 15.24,67.5 X1.P$1
CC1  (via drill 0.35)
  Top 0.254: F1.P$1 56.98,24.37 v56.01,25.34
  Bottom 0.254: v56.01,25.34 54.74,26.61 54.74,32.89 17.42,70.21 X1.P$2
CC2  (via drill 0.38)
  Top 0.254: F2.P$1 76.67,35.31 v72.52,35.31
  Bottom 0.254: v72.52,35.31 67.44,40.39 57.54,40.39 50.94,46.99 45.77,46.99 20.05,72.71 X1.P$3
CC3  (via drill 0.38)
  Top 0.254: F3.P$1 61.79,44.32 v66.04,44.32
  Bottom 0.254: v66.04,44.32 58.49,44.32 52.37,50.44 47.2,50.44 22.44,75.21 X1.P$4
CC4  (via drill 0.38)
  Top 0.254: F4.P$1 74.93,61.37 74.91,61.34 v72.26,61.34
  Bottom 0.254: v72.26,61.34 72.26,61.15 64.77,53.66 60.3,53.66 51.41,62.55 40.01,62.55 24.84,77.71 X1.P$5
CC5  (via drill 0.35, 0.38)
  Top 0.254: v65.91,70.48 61.87,70.48 F5.P$1 | v23.5,83.95 19.68,80.14 19.68,64.27 18.9,63.48 13.65,63.48 12.74,64.39 X1.P$6
  Bottom 0.254: v65.91,70.48 36.96,70.48 v23.5,83.95
CC6  (via drill 0.35, 0.38)
  Top 0.254: F6.P$1 76.5,88.77 v72.52,88.77 | v28.84,84.09 23.34,78.58 23.34,62.72 20.64,60.03 12.22,60.03 9.29,62.96 9.29,67.71 11.79,70.21 X1.P$7
  Bottom 0.254: v72.52,88.77 67.25,83.5 54.29,83.5 51.12,86.68 36.51,86.68 33.92,84.09 v28.84,84.09
CC7  (via drill 0.35, 0.38)
  Top 0.254: v65.53,97.41 61.79,97.41 F7.P$1 | v28.69,88.79 29.31,88.79 32.5,85.6 32.5,82.57 26.79,76.87 26.79,61.29 22.07,56.57 10.79,56.57 5.83,61.53 5.83,69.29 9.25,72.71 X1.P$8
  Bottom 0.254: v28.69,88.79 37.31,97.41 v65.53,97.41
CC8  (via drill 0.35, 0.38)
  Top 0.254: v72.39,115.32 76.68,115.32 F8.P$1 | v28.96,94.23 29.05,94.23 35.95,87.33 35.95,81.14 30.25,75.44 30.25,59.86 23.51,53.12 9.36,53.12 2.38,60.1 2.38,71.04 6.54,75.21 X1.P$9
  Bottom 0.254: v72.39,115.32 68.83,111.76 46.35,111.76 28.96,94.37 v28.96,94.23
DRAIN1:GATE
  Top 0.254: DRAIN1:PFET.1 30.77,19.68 DRAIN1:GATE.1
DRAIN1:N$1
  Top 0.254: DRAIN1:PFET.3 33.72,15.57 35.57,13.72 38.1,13.72 | DRAIN1:DISCHARGE.1 38.1,13.72 | 38.1,13.72 36.83,14.99 DRAIN1:LED1.A
DRAIN1:N$2
  Top 0.254: DRAIN1:R1.2 DRAIN1:LED1.C
DRAIN2:GATE
  Top 0.254: DRAIN2:GATE.1 94.18,37.7 DRAIN2:PFET.1
DRAIN2:N$1
  Top 0.254: DRAIN2:LED1.A 88.14,34.54 | 88.14,34.54 DRAIN2:PFET.3 | DRAIN2:DISCHARGE.1 94.87,34.54 88.14,34.54
DRAIN2:N$2
  Top 0.254: DRAIN2:R1.2 DRAIN2:LED1.C
DRAIN3:GATE
  Top 0.254: DRAIN3:GATE.1 42.35,33.54 DRAIN3:PFET.1
DRAIN3:N$1
  Top 0.254: DRAIN3:LED1.A 51.03,35.54 DRAIN3:PFET.3 41.93,35.54 40.45,37.02 40.45,39.81 DRAIN3:DISCHARGE.1
DRAIN3:N$2
  Top 0.254: DRAIN3:R1.2 DRAIN3:LED1.C
DRAIN4:GATE
  Top 0.254: DRAIN4:GATE.1 94.18,64.37 DRAIN4:PFET.1
DRAIN4:N$1
  Top 0.254: DRAIN4:LED1.A 88.14,61.21 | DRAIN4:DISCHARGE.1 96.77,58.17 93.73,61.21 88.14,61.21 | DRAIN4:PFET.3 88.14,61.21
DRAIN4:N$2
  Top 0.254: DRAIN4:R1.2 DRAIN4:LED1.C
DRAIN5:GATE
  Top 0.254: DRAIN5:GATE.1 42.35,60.21 DRAIN5:PFET.1
DRAIN5:N$1
  Top 0.254: DRAIN5:LED1.A 51.01,62.2 44.21,62.2 DRAIN5:PFET.3 41.93,62.21 40.39,63.75 DRAIN5:DISCHARGE.1
DRAIN5:N$2
  Top 0.254: DRAIN5:LED1.C DRAIN5:R1.2
DRAIN6:GATE
  Top 0.254: DRAIN6:GATE.1 94.18,91.04 DRAIN6:PFET.1
DRAIN6:N$1
  Top 0.254: DRAIN6:LED1.A DRAIN6:PFET.3 91.81,89.04 DRAIN6:DISCHARGE.1
DRAIN6:N$2
  Top 0.254: DRAIN6:LED1.C DRAIN6:R1.2
DRAIN7:GATE
  Top 0.254: DRAIN7:GATE.1 42.35,86.88 DRAIN7:PFET.1
DRAIN7:N$1
  Top 0.254: DRAIN7:DISCHARGE.1 40.39,91.57 43.1,88.85 44.67,88.85 DRAIN7:PFET.3 51.03,88.88 DRAIN7:LED1.A
DRAIN7:N$2
  Top 0.254: DRAIN7:LED1.C DRAIN7:R1.2
DRAIN8:GATE
  Top 0.254: DRAIN8:PFET.1 92.59,116.13 DRAIN8:GATE.1
DRAIN8:N$1
  Top 0.254: DRAIN8:LED1.A DRAIN8:PFET.3 93.39,114.13 DRAIN8:DISCHARGE.1
DRAIN8:N$2
  Top 0.254: DRAIN8:R1.2 DRAIN8:LED1.C
DRAIN9:GATE
  Top 0.254: DRAIN9:GATE.1 42.35,113.43 DRAIN9:PFET.1
DRAIN9:N$1
  Top 0.254: DRAIN9:LED1.A 51.03,115.43 DRAIN9:PFET.3 44.05,115.57 41.91,115.57 40.39,117.09 DRAIN9:DISCHARGE.1
DRAIN9:N$2
  Top 0.254: DRAIN9:LED1.C DRAIN9:R1.2
DRIVE_B  (via drill 0.38)
  Top 0.254: U2.38 115.61,78.95 v115.72,78.85 | v108.63,45.96 110.39,47.72 Q2.1
  Bottom 0.254: v115.72,78.85 115.72,77.61 116.38,76.95 116.38,67.44 114.85,65.92 114.85,61.96 111.3,58.41 111.3,49.64 108.63,46.98 v108.63,45.96 108.63,44.66 110.62,42.67 U$7.P$1
IM_B  (via drill 0.38)
  Top 0.254: U2.41 111.42,80.45 111.04,80.84 111.04,90.11 105.71,95.44 105.71,106.92 v105.45,107.17 | TRANSFORMER.P$12 104.7,132.37 104.3,131.97 104.3,123.44 C3_B.2 105.54,121.53 v105.54,113.57
  Bottom 0.254: v105.45,107.17 105.54,107.26 105.54,107.27 v105.54,113.57
IP_B  (via drill 0.38)
  Top 0.254: U2.42 111.93,80.95 111.68,81.21 111.68,90.68 106.47,95.89 v106.47,103.39 | v104.35,135.79 104.93,136.37 TRANSFORMER.P$10 | R3_B.1 106.51,127.88 v106.51,129.06
  Bottom 0.254: v104.35,135.79 104.27,135.71 104.27,131.3 v106.51,129.06 106.47,129.02 v106.47,103.39
ISOSPI-M
  Top 0.254: R5_B.2 120.95,126.64 X2.2
ISOSPI-P
  Top 0.254: X2.1 117.98,120.48 117.98,126.65 R4_B.2
N$1
  Top 0.254: C4_B.1 102.7,133.28 103.8,134.37 TRANSFORMER.P$11
N$2
  Top 0.254: RB1_B.2 118.88,81.95 U2.44
N$3
  Top 0.254: F9.P$1 52.76,133.35 37.78,133.35 12.74,108.31 X1.P$10
N$4
  Top 0.254: U2.43 115.11,81.45 117.71,78.85 RB2_B.2 118.95,79.58 120.65,81.28 RB1_B.1
N$5
  Top 0.254: TRANSFORMER.P$3 119.39,136.37 117.64,134.62 117.64,128.69 R4_B.1
N$7
  Top 0.254: TRANSFORMER.P$1 120.94,132.11 120.94,128.44 R5_B.1
N$8
  Top 0.254: U2.48 112.77,91.22 108.08,95.91 J8_B.1 J7_B.1
N$9
  Top 0.254: U2.47 113.71,83.45 114.06,83.81 114.06,92.19 111.89,94.36 J6_B.1 J5_B.1
N$10
  Top 0.254: R3_B.2 107.58,123.59 C3_B.1
N$13  (via drill 0.38)
  Top 0.254: U2.46 114.34,82.95 115.06,83.67 v115.06,84.33 | J3_B.1 J4_B.1 115.36,103.92 112.95,101.52 112.95,95.71 v113.41,95.25
  Bottom 0.254: v115.06,84.33 113.41,85.98 v113.41,95.25
N$16
  Top 0.254: U2.45 114.85,82.45 121.41,89.02 J1_B.1 J2_B.1
S1_B  (via drill 0.38)
  Top 0.254: U2.25 112.77,71.06 112.06,70.34 106.09,70.34 103.17,67.42 103.17,22.33 92,11.17 v31.23,11.17 | DRAIN1:GATE.2 26.9,19.68 25.3,18.09 v25.3,11.79
  Bottom 0.254: v25.3,11.79 25.92,11.17 v31.23,11.17
S2_B
  Top 0.254: U2.23 103.67,72.95 101.9,71.18 101.9,44.87 99.02,42 DRAIN2:GATE.2
S3_B  (via drill 0.38)
  Top 0.254: U2.21 103.17,73.95 100.5,71.29 100.5,51.21 v100.54,51.17 | v60.34,29.25 58.43,27.34 40.39,27.34 DRAIN3:GATE.2
  Bottom 0.254: v60.34,29.25 104.88,29.25 106.17,30.54 106.17,47.16 102.81,50.53 101.17,50.53 v100.54,51.17
S4_B
  Top 0.254: U2.19 102.64,74.95 96.77,69.09 DRAIN4:GATE.2
S5_B  (via drill 0.38)
  Top 0.254: U2.17 107.61,75.95 107.99,75.57 v107.99,74.79 | v56.9,49.91 54.24,52.56 41.84,52.56 DRAIN5:GATE.2 | v106.95,45.91 104.86,45.91 v104.83,45.95 | v106.14,65.97 106.14,55.58 v106.55,55.17
  Bottom 0.254: v107.99,74.79 107.99,73.9 106.1,72.01 106.14,71.97 v106.14,65.97 | v56.9,49.91 58.65,48.16 78.74,48.16 82.65,52.07 94.19,52.07 100.31,45.95 v104.83,45.95 | v106.95,45.91 106.7,46.15 106.7,55.01 v106.55,55.17
S7_B
  Top 0.254: DRAIN6:GATE.2 97.7,95.34 97.92,95.12 97.92,81.94 98.82,81.04 98.82,80.25 101.11,77.95 U2.13
S8_B  (via drill 0.38)
  Top 0.254: v100.85,80.11 102.01,78.95 U2.11 | DRAIN7:GATE.2 41.36,81.95 v41.69,81.62
  Bottom 0.254: v100.85,80.11 97.79,80.11 95.14,77.47 67.31,77.47 64.67,80.11 43.2,80.11 v41.69,81.62
S9_B
  Top 0.254: U2.9 103.29,79.95 99.19,84.06 99.19,120.52 97.7,122.01 DRAIN8:GATE.2
S10_B  (via drill 0.38)
  Top 0.254: U2.7 103.93,80.95 101.28,83.61 101.28,100.33 v100.64,100.97 | v57.03,102.99 57.03,103.02 53.91,106.13 41.48,106.13 DRAIN9:GATE.2
  Bottom 0.254: v57.03,102.99 57.06,102.99 58.91,101.13 100.48,101.13 v100.64,100.97
SENSE1  (via drill 0.38)
  Top 0.254: v63.46,19.18 68.65,24.37 F1.P$2 86.56,24.37 DRAIN2:R1.1 89.53,27.34 89.53,30.47 DRAIN2:DISCHARGE.2 | DRAIN1:R.1 30.49,17.96 v30.49,18.07 v30.48,18.09 31.07,18.09 DRAIN1:PFET.2
  Bottom 0.254: v63.46,19.18 57.62,13.34 38.73,13.34 33.98,18.09 v30.48,18.09
SENSE2
  Top 0.254: DRAIN2:R.1 90.59,39.19 88.68,39.19 DRAIN2:PFET.2 85.72,36.24 85.72,34.29 83.19,31.75 70.29,31.75 66.68,35.37 F2.P$2 59.97,35.37 DRAIN3:R1.1 48.86,43.27 DRAIN3:DISCHARGE.2
SENSE3  (via drill 0.38)
  Top 0.254: v56.26,33.55 v56.25,33.54 DRAIN3:PFET.2 44.2,32.59 DRAIN3:R.1 | v66.86,36.58 74.66,44.37 F3.P$2 79.89,44.37 DRAIN4:R1.1 90.17,54.65 90.17,55.88 DRAIN4:DISCHARGE.2
  Bottom 0.254: v66.86,36.58 63.84,33.55 v56.26,33.55
SENSE4
  Top 0.254: DRAIN4:R.1 90.49,65.77 89.17,65.77 87.78,64.37 DRAIN4:PFET.2 86.39,65.18 72.75,65.18 68.94,61.37 F4.P$2 60.64,61.37 DRAIN5:R1.1 48.86,69.94 DRAIN5:DISCHARGE.2
SENSE5  (via drill 0.38)
  Top 0.254: v57.28,60.33 57.2,60.25 52.54,60.25 DRAIN5:R.1 RU2_B.1 44.2,59.26 DRAIN5:PFET.2 | v69.22,65.15 74.43,70.37 F5.P$2 79.22,70.37 DRAIN6:R1.1 91.7,82.85 DRAIN6:DISCHARGE.2
  Bottom 0.254: v57.28,60.33 64.39,60.33 v69.22,65.15
SENSE6
  Top 0.254: DRAIN7:DISCHARGE.2 48.68,93.22 DRAIN7:R1.1 59.68,89 F6.P$2 69.28,89 73.66,84.62 82.3,84.62 87.19,89.51 DRAIN6:PFET.2 88.24,92.1 90.15,92.1 DRAIN6:R.1
SENSE7  (via drill 0.38)
  Top 0.254: v69.34,92.96 73.74,97.37 76.07,97.37 | 76.07,97.37 F7.P$2 | 76.07,97.37 76.41,97.03 79.21,97.03 DRAIN8:R1.1 90.17,107.99 90.17,109.22 DRAIN8:DISCHARGE.2 | DRAIN7:R.1 45.65,85.11 DRAIN7:PFET.2 45.72,86.82 v56.16,86.82
  Bottom 0.254: v56.16,86.82 63.2,86.82 v69.34,92.96
SENSE8
  Top 0.254: DRAIN9:DISCHARGE.2 48.86,123.15 DRAIN9:R1.1 52.07,122.99 59.69,115.37 F8.P$2 68.22,115.37 71.63,118.77 84.54,118.77 DRAIN8:PFET.2 87.19,118.94 88.56,120.31 DRAIN8:R.1
UNUSED1_B  (via drill 0.38)
  Top 0.254: U2.4 104.8,82.45 102.91,84.34 102.91,85.81 | RU1_B.2 46.24,108.5 v46.43,108.31 | v102.67,103.63 102.91,103.39 102.91,85.81 | U2.2 105.27,83.45 102.91,85.81
  Bottom 0.254: v46.43,108.31 47.19,107.54 98.75,107.54 v102.67,103.63
UNUSED2_B  (via drill 0.38)
  Top 0.254: U2.14 101.84,77.45 v99.31,74.93 | v57.02,61.85 56.57,61.39 49.58,61.39 v47.32,59.13 | v46.63,55.35 46.57,55.28 RU2_B.2
  Bottom 0.254: v57.02,61.85 61.94,66.76 67.45,66.76 75.62,74.93 v99.31,74.93 | v47.32,59.13 47.32,56.03 v46.63,55.35
V+_B
  Top 0.254: C6_B.1 R1_B.2 106.02,86.5 U2.1
V-_A  (via drill 0.38)
  Top 0.254: v69.34,119.51 74.14,124.3 76.67,124.3 F9.P$2 79.68,127.32 98.42,127.32 101.56,124.19 101.56,114.72 103.5,112.78 103.5,92.1 v105.42,90.18 106.17,89.44 R1_B.1 | v57.15,114.55 56.02,113.43 DRAIN9:PFET.2 44.2,112.48 RU1_B.1 DRAIN9:R.1 | RIN_B.1 107.36,56.81 v107.36,62.34
  Bottom 0.254: v107.36,62.34 107.36,72.38 109.64,74.66 109.64,80.98 105.42,85.2 v105.42,90.18 | v57.15,114.55 62.1,119.51 v69.34,119.51
V-_B  (via drill 0.38)
  Top 0.254: RB2_B.1 C2_B.2 C1_B.2 120.65,71.06 119.41,69.82 | U2.31 U2.30 | U2.31 113.58,75.45 114.09,74.95 114.09,73.52 117.79,69.82 119.41,69.82 | U2.31 111.01,75.45 109.77,76.69 109.77,84.19 110.41,84.82 110.41,87.38 109.43,88.35 C6_B.2 109.22,89.92 104.5,94.64 v104.5,99.21 v104.49,99.21 104.49,108.25 | 116.71,108.32 112.65,108.32 | 108.97,108.32 112.65,108.32 | 116.71,108.32 120.54,108.32 v121.41,107.44 J1_B.2 | 103.93,53.96 v103.93,46.86 103.93,22.01 v101.6,19.68 | v110.49,53.98 110.49,54.23 115.18,58.92 116.64,58.92 117.4,58.17 C8_B.2 117.64,58.12 C7_B.2 | 104.49,108.25 104.49,118.61 104.44,118.67 | 104.44,118.67 v104.44,118.87 | v99.18,124.63 99.12,124.68 86.16,124.68 84.73,123.26 84.73,121.67 86.09,120.31 DRAIN8:C.2 | v87.04,99.97 86.13,99.97 81.79,95.63 v81.79,93.95 82.65,93.09 86.07,93.09 DRAIN6:C.2 | C4_B.2 102.7,120.41 104.44,118.67 | v46.53,31.24 48.68,31.24 49.28,30.65 DRAIN3:C.2 | DRAIN5:C.2 61.42,56.98 v61.47,56.94 61.62,56.94 71.45,47.1 v71.45,44.88 | 85.72,43.94 84.72,42.94 84.72,40.63 85.05,40.3 DRAIN2:C.2 | v100.2,47.5 100.2,45.97 98.17,43.94 91.78,43.94 90,45.72 87.5,45.72 85.72,43.94 | 108.97,108.32 104.56,108.32 104.49,108.25 | 85.72,43.94 81.92,43.94 v81.79,43.81 | DRAIN1:C.2 27.09,11.43 26.28,10.62 24.59,10.62 23.89,11.31 23.89,19.54 26.67,22.31 DRAIN1:R1.1 | 103.93,53.96 103.93,65.16 107.09,68.33 R2_B.1 108.63,66.97 C_5.2 116.56,66.97 119.41,69.82 | 103.93,53.96 v107.48,53.96 | J7_B.2 109.98,107.3 108.97,108.32 | 112.65,108.32 113.79,107.17 J5_B.2 | J3_B.2 117.6,107.43 116.71,108.32 | DRAIN9:C.2 54.46,110.3 57.21,110.3 62.74,104.78 65.53,104.78 v72.39,97.92
  Top 0.254: DRAIN7:C.2 51.16,85.53 65.91,85.53 v66.55,86.17 | v40.01,33.58 38.26,33.58 36.83,32.16 DRAIN1:R1.1 | DRAIN4:C.2 86.32,66.67 v81.28,66.67 | v97.16,19.05 65.6,19.05 61.91,15.37 F0.P$2 47.12,15.37 DRAIN1:DISCHARGE.2 43.94,15.24 39.37,15.24 38.1,16.51 38.1,21.04 DRAIN1:R1.1
  Bottom 0.254: v100.2,47.5 103.29,47.5 v103.93,46.86 | v61.47,56.94 64.62,56.94 74.36,66.67 v81.28,66.67 | v66.55,86.17 66.55,86.23 73.41,93.09 | v72.39,97.92 72.39,94.11 73.41,93.09 | v110.49,53.98 110.48,53.96 v107.48,53.96 | v104.44,118.87 104.44,119.36 v99.18,124.63 | v87.04,99.97 87.06,99.95 103.75,99.95 v104.5,99.21 | v46.53,31.24 42.72,31.24 40.38,33.58 v40.01,33.58 | v81.79,43.81 72.52,43.81 v71.45,44.88 | v81.79,93.95 80.92,93.09 73.41,93.09 | v121.41,107.44 121.41,95.28 U$6.P$1 | v101.6,19.68 100.97,19.05 v97.16,19.05
VIN_B
  Top 0.254: 106.68,50.02 Q2.2 115.94,54.25 C7_B.1 | Q2.4 106.68,50.02 | RIN_B.2 109.73,53.08 106.68,50.02
VREF1_B
  Top 0.254: U2.35 115.87,77.45 117.64,75.68 C2_B.1
VREF2_B  (via drill 0.38)
  Top 0.254: U2.34 115.1,76.95 v115.55,76.5 118.95,73.1 C1_B.1
  Bottom 0.254: v115.55,76.5 115.61,76.44 115.61,67.8 114.03,66.22 114.03,62.41 109.52,57.9 108.14,57.9 103.31,53.07 80.43,53.07 v80.08,52.72
VREG_B  (via drill 0.38)
  Top 0.254: U2.40 111.8,79.95 | 111.8,79.95 111.41,79.57 111.41,78.84 111.8,78.45 U2.37 U2.36 116.38,77.95 v117.01,77.33 | J4_B.2 v115.7,106.93 | 111.8,79.95 111.86,80.01 v114.17,80.01 | J8_B.2 v108.08,106.93 | J2_B.2 119.51,106.81 v119.38,106.93 | J6_B.2 v111.89,106.93 | C8_B.1 115.99,56.95 v113.28,54.24 113.28,53.89 Q2.3
  Bottom 0.254: v117.01,77.33 117.01,57.97 v113.28,54.24 | v119.38,106.93 v115.7,106.93 112.14,106.93 | 112.14,106.93 112.14,85.85 114.17,83.82 v114.17,80.01 | v108.08,106.93 v111.89,106.93 112.14,106.93

### Text on the board
tDocu: TS | TS | isoSPI | 8 | 7 | x8 | x4 | x2 | x1 | 1 | 0 | 1 | 0 | 1 | 0 | 1 | 0 | 6 | V-_B | 5 | DANGER HIGH VOLTAGE | DANGER HIGH VOLTAGE | 4 | 3 | DRIVE_B | 2 | 1 | HyTech Racing 2021 / Cell Charger BMS rev 1 / Designed by Leo Pozdneev, / based on BMS Segment rev 14 / by Arvind Srinivasan | 0 | - | Cell 0
bDocu: TS | TS | isoSPI | DANGER HIGH VOLTAGE | DANGER HIGH VOLTAGE